# EAGLE schematic headset_br (EAGLE 6.5.0)

## Sheet 1 of 10
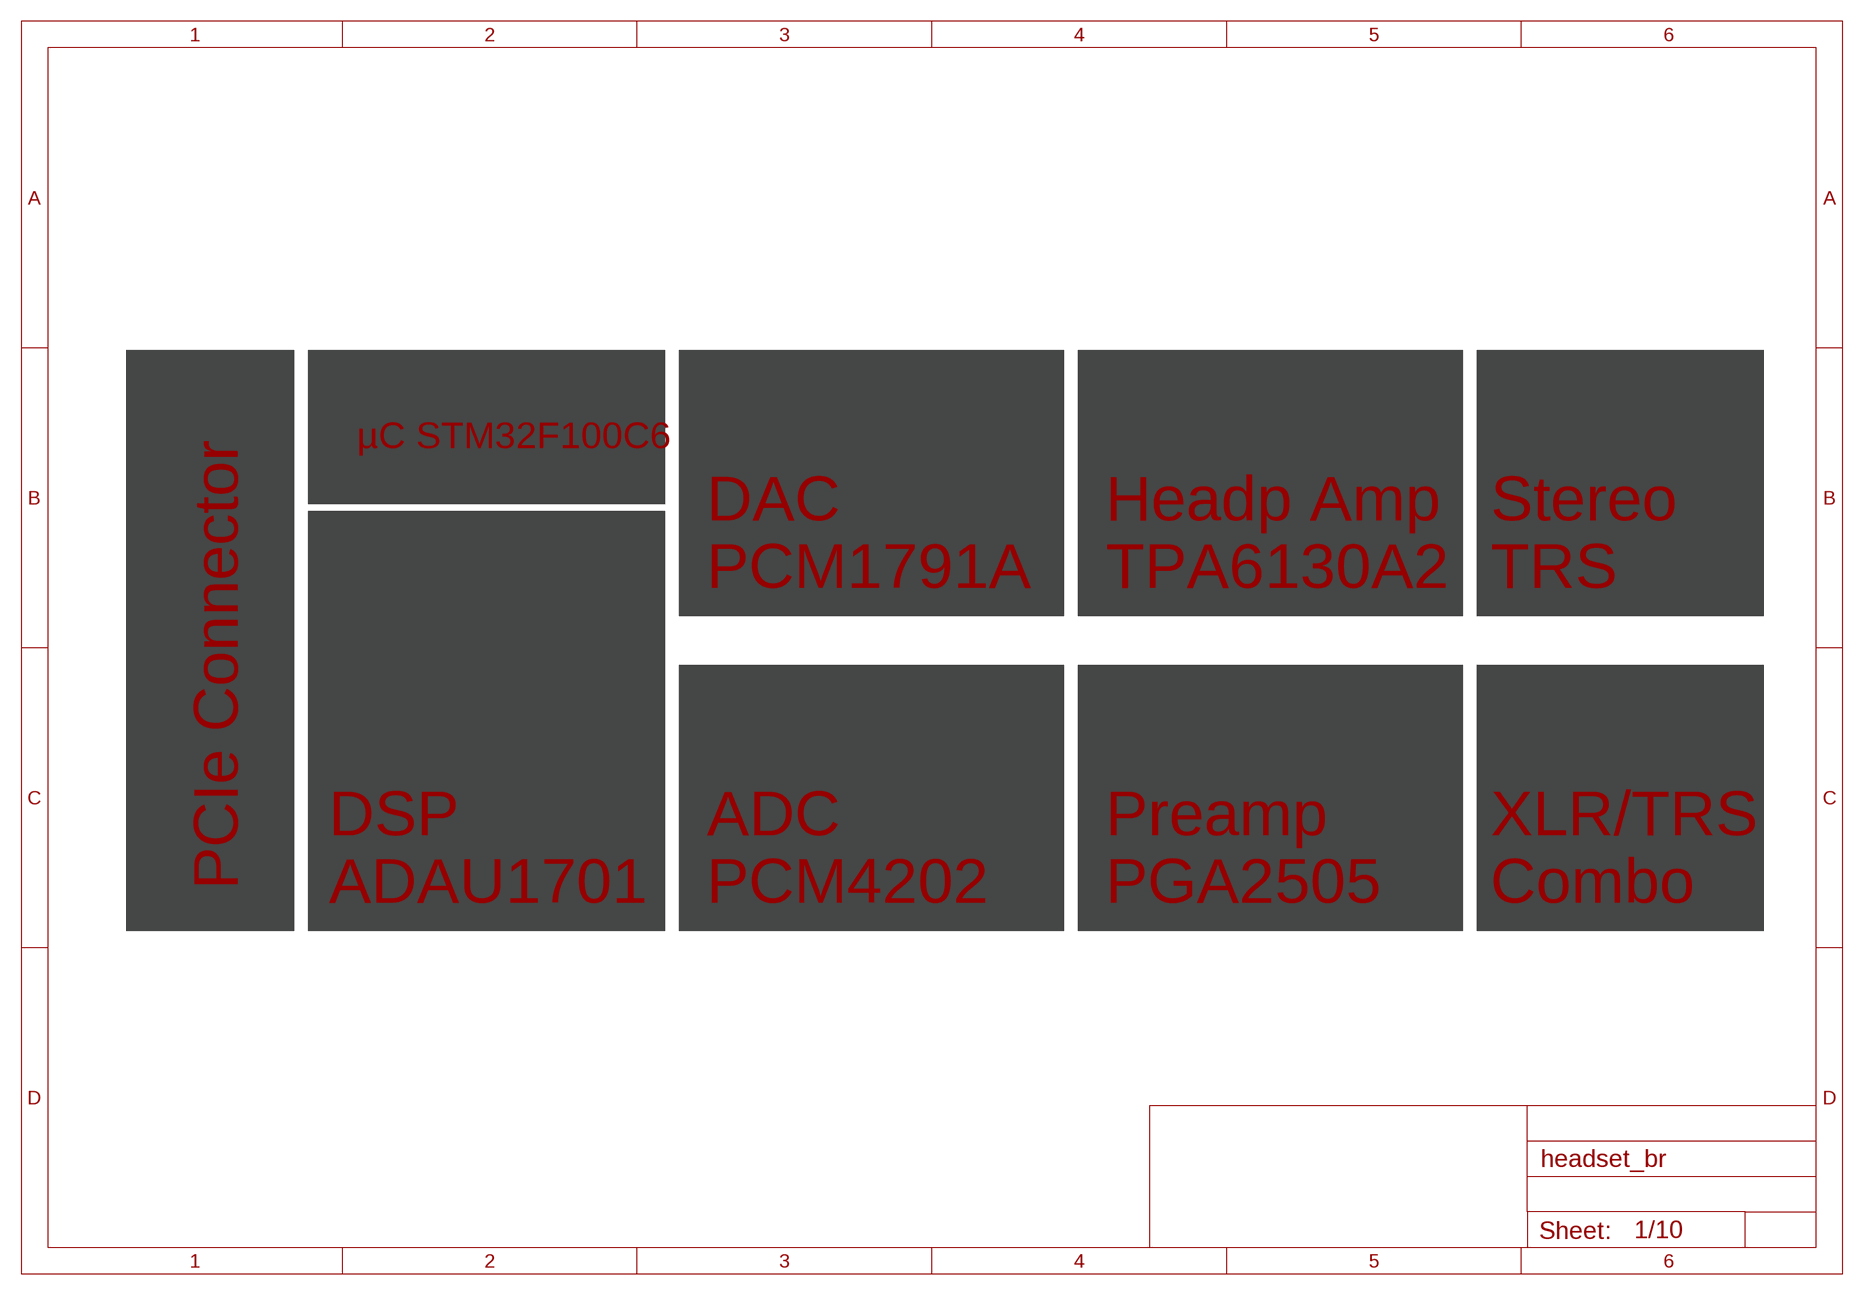
[diagram p0: schematic, sheet 1]
FRAME1 (FRAME): EXCLUDE_FROM_BOM: YES

### Notes on the sheet
- µC STM32F100C6
- DAC
  PCM1791A
- Headp Amp
  TPA6130A2
- Stereo
  TRS
- PCIe Connector
- DSP
  ADAU1701
- ADC
  PCM4202
- Preamp
  PGA2505
- XLR/TRS
  Combo

## Sheet 2 of 10
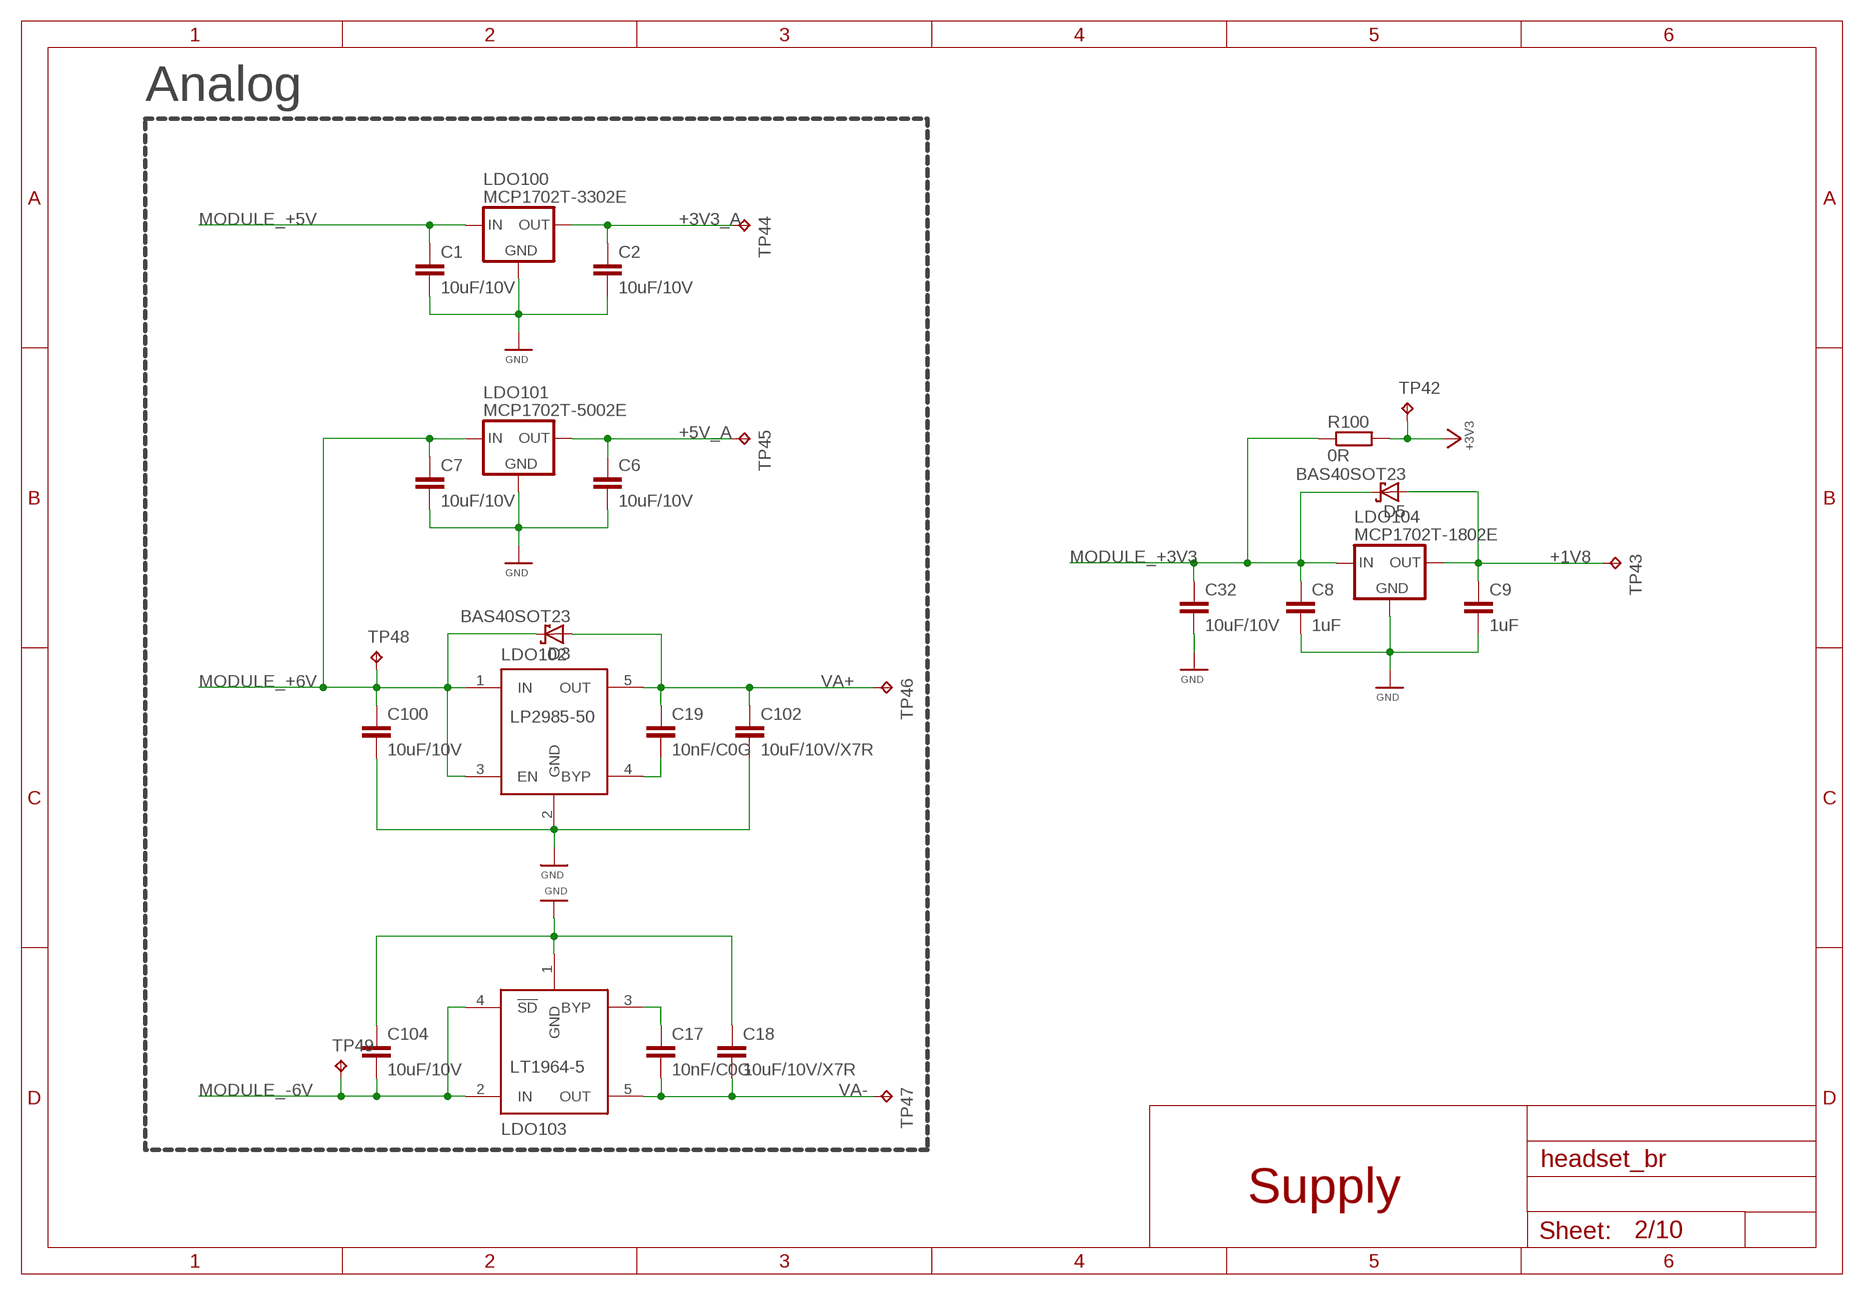
[diagram p1: schematic, sheet 2]
FRAME7 (FRAME): EXCLUDE_FROM_BOM: YES

### Parts
C1  10uF/10V  C0805  [C0805]
C2  10uF/10V  C0805  [C0805]
C6  10uF/10V  C0805  [C0805]
C7  10uF/10V  C0805  [C0805]
C8  1uF  C0603  [C0603]
C9  1uF  C0603  [C0603]
C17  10nF/C0G  C0603  [C0603]
C18  10uF/10V/X7R  C0805  [C0805]
C19  10nF/C0G  C0603  [C0603]
C32  10uF/10V  C0805  [C0805]
C100  10uF/10V  C0805  [C0805]
C102  10uF/10V/X7R  C0805  [C0805]
C104  10uF/10V  C0805  [C0805]
D3  BAS40SOT23  [SOT23]
D5  BAS40SOT23  [SOT23]
LDO100  MCP1702T-3302E  MCP1700  [SOT23]
LDO101  MCP1702T-5002E  MCP1700  [SOT23]
LDO102  LP2985-50  LP2985  [SOT23-5]
LDO103  LT1964-5  [SOT23-5]
LDO104  MCP1702T-1802E  MCP1700  [SOT23]
R100  0R  R0603  [R0603]
TP42  TPS  [TESTPAD_SMALL]
TP43  TPS  [TESTPAD_SMALL]
TP44  TPS  [TESTPAD_SMALL]
TP45  TPS  [TESTPAD_SMALL]
TP46  TPS  [TESTPAD_SMALL]
TP47  TPS  [TESTPAD_SMALL]
TP48  TPS  [TESTPAD_SMALL]
TP49  TPS  [TESTPAD_SMALL]

### Nets
+1V8: C9.1 D5.1(A) LDO104.2(OUT) TP43.P$1(TP) ; also sheet 5
+3V3: R100.2 TP42.P$1(TP) ; also sheet 4,5,10
+3V3_A: C2.1 LDO100.2(OUT) TP44.P$1(TP) ; also sheet 7,8,9
+5V_A: C6.1 LDO101.2(OUT) TP45.P$1(TP) ; also sheet 7,8,9
GND: C1.2 C2.2 C6.2 C7.2 C8.2 C9.2 C18.1 C32.2 C100.2 C102.2 C104.1 LDO100.1(GND) LDO101.1(GND) LDO102.2(GND) LDO103.1(GND) LDO104.1(GND) ; also sheet 3,4,5,6,7,8,9,10
MODULE_+3V3: C8.1 C32.1 D5.3(C) LDO104.3(IN) R100.1 ; also sheet 10
MODULE_+5V: C1.1 LDO100.3(IN) ; also sheet 10
MODULE_+6V: C7.1 C100.1 D3.3(C) LDO101.3(IN) LDO102.1(IN) LDO102.3(EN) TP48.P$1(TP) ; also sheet 10
MODULE_-6V: C104.2 LDO103.2(IN) LDO103.4(!SD) TP49.P$1(TP) ; also sheet 10
N$57: C17.1 LDO103.3(BYP)
N$58: C19.2 LDO102.4(BYP)
VA+: C19.1 C102.1 D3.1(A) LDO102.5(OUT) TP46.P$1(TP) ; also sheet 6
VA-: C17.2 C18.2 LDO103.5(OUT) TP47.P$1(TP) ; also sheet 6

### Notes on the sheet
- Analog
- Supply

## Sheet 3 of 10
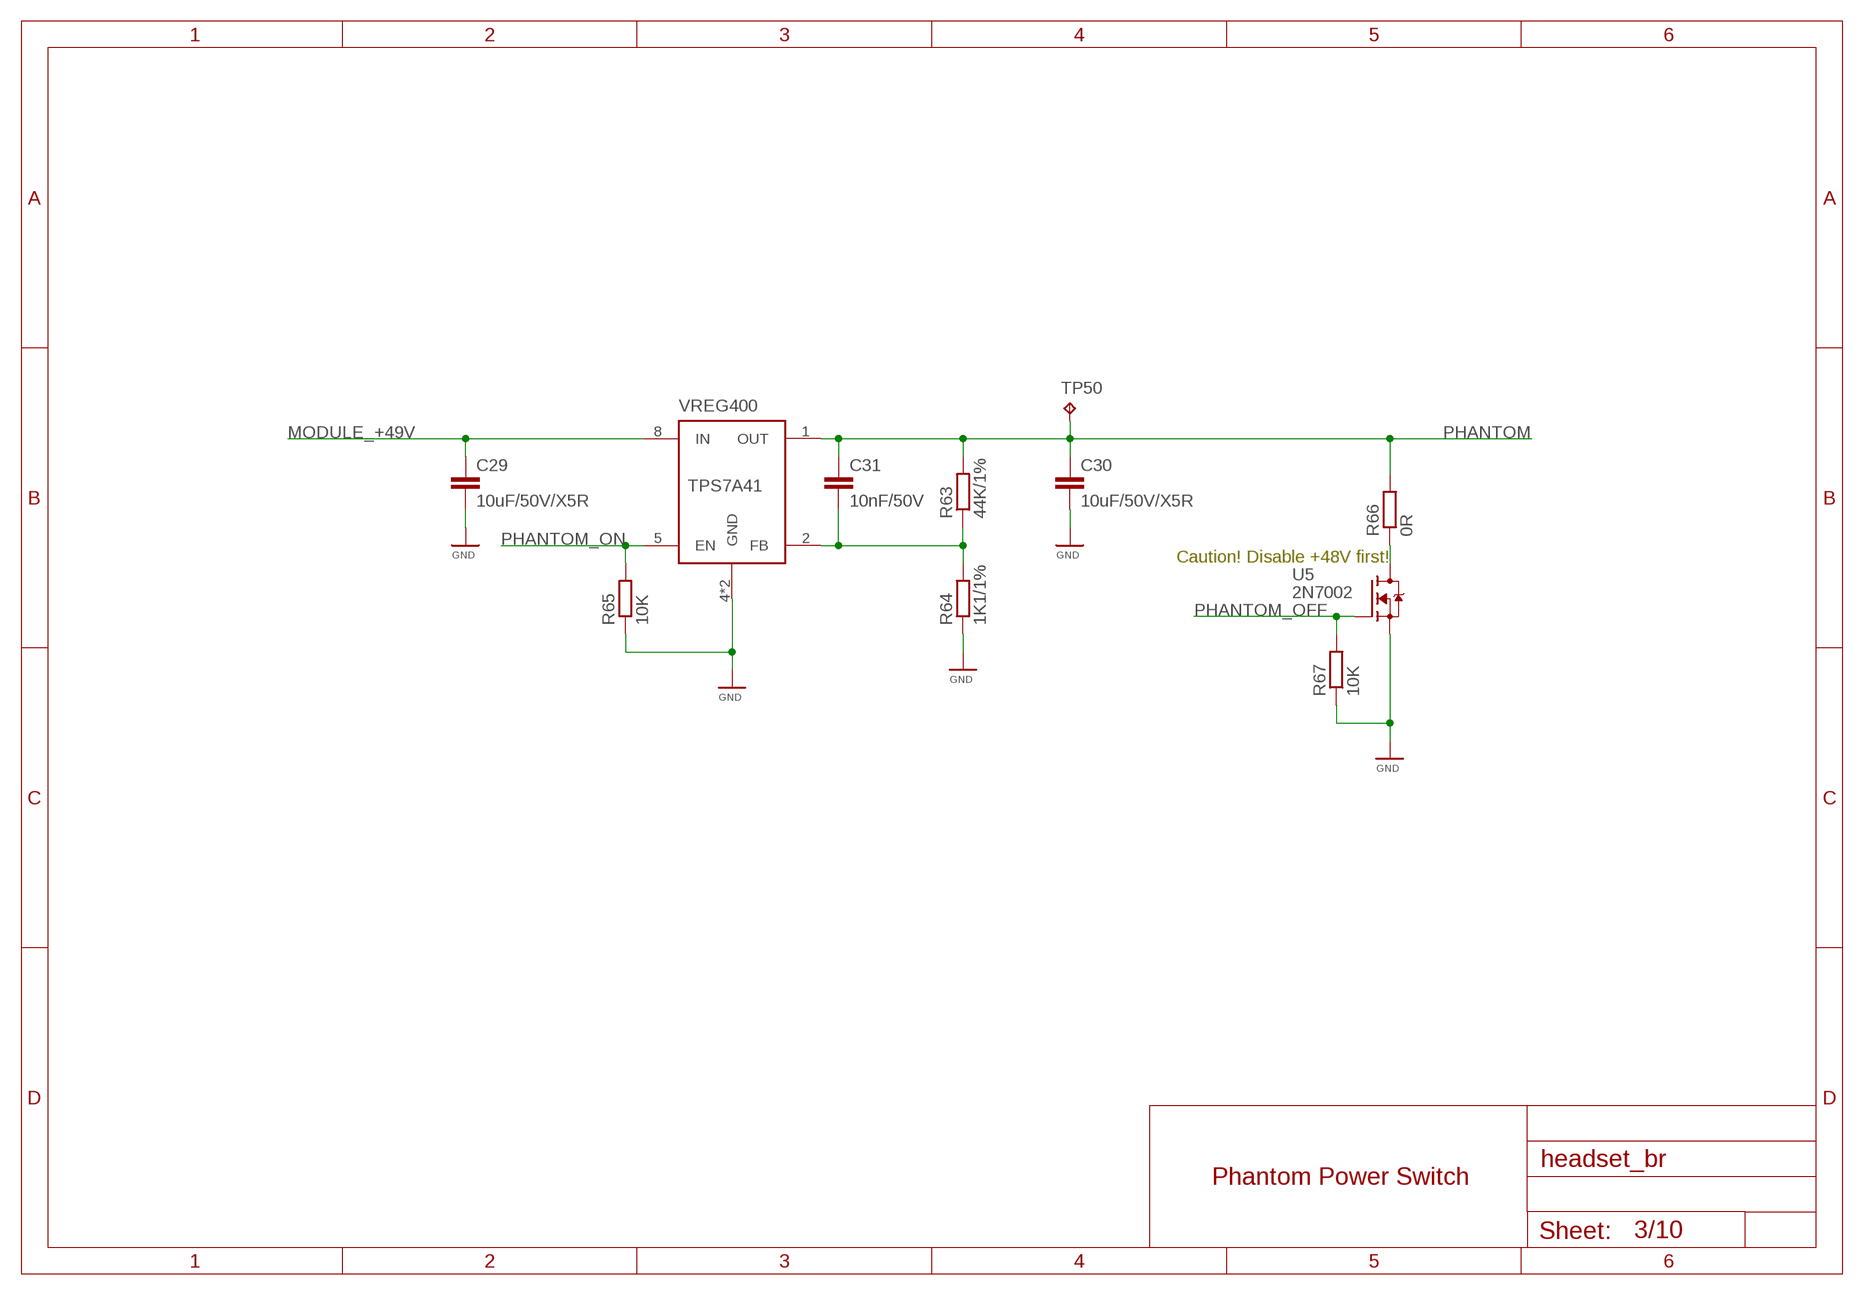
[diagram p2: schematic, sheet 3]
FRAME10 (FRAME): EXCLUDE_FROM_BOM: YES

### Parts
C29  10uF/50V/X5R  C1206  [C1206]
C30  10uF/50V/X5R  C1206  [C1206]
C31  10nF/50V  C0603  [C0603]
R63  44K/1%  R0603  [R0603]
R64  1K1/1%  R0603  [R0603]
R65  10K  R0603  [R0603]
R66  0R  R0603  [R0603]
R67  10K  R0603  [R0603]
TP50  TPS  [TESTPAD_SMALL]
U5  2N7002  [SOT23]
VREG400  TPS7A41  [TPS7A41]

### Nets
GND: C29.2 C30.2 R64.1 R65.1 R67.1 U5.2(S) VREG400.4(GND) VREG400.POWERPAD(GND) ; also sheet 2,4,5,6,7,8,9,10
MODULE_+49V: C29.1 VREG400.8(IN) ; also sheet 10
N$106: C31.2 R63.1 R64.2 VREG400.2(FB)
N$107: R66.1 U5.3(D)
PHANTOM: C30.1 C31.1 R63.2 R66.2 TP50.P$1(TP) VREG400.1(OUT) ; also sheet 6
PHANTOM_OFF: R67.2 U5.1(G) ; also sheet 4
PHANTOM_ON: R65.2 VREG400.5(EN) ; also sheet 4

### Notes on the sheet
- Caution! Disable +48V first!
- Phantom Power Switch

## Sheet 4 of 10
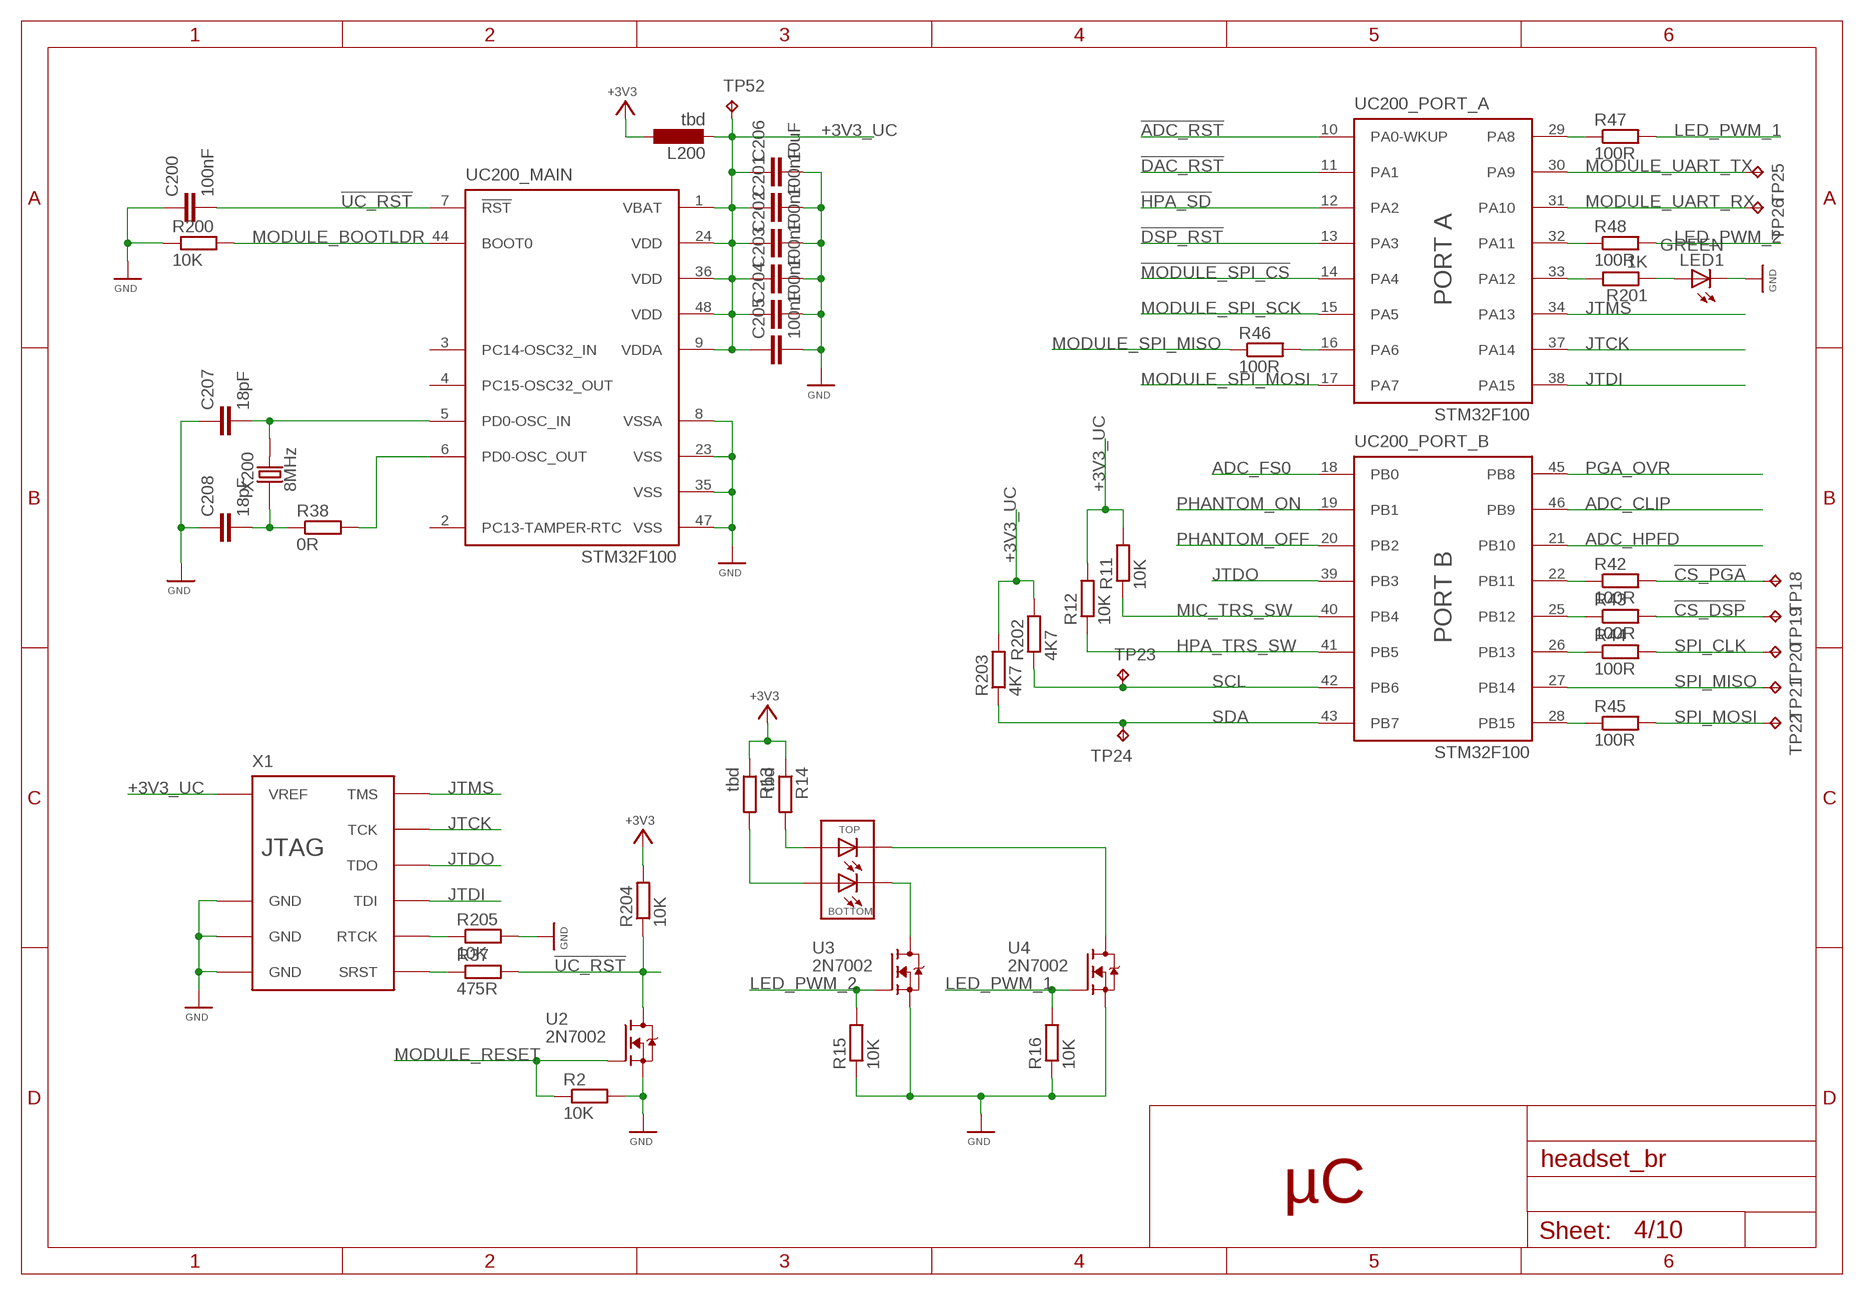
[diagram p3: schematic, sheet 4]
FRAME3 (FRAME): EXCLUDE_FROM_BOM: YES

### Parts
C200  100nF  C0603  [C0603]
C201  100nF  C0603  [C0603]
C202  100nF  C0603  [C0603]
C203  100nF  C0603  [C0603]
C204  100nF  C0603  [C0603]
C205  100nF  C0603  [C0603]
C206  10uF  C0805  [C0805]
C207  18pF  C0603  [C0603]
C208  18pF  C0603  [C0603]
DUOLED  MENTOR-2LEDRED/GREEN  [MENTOR-2LED]
L200  tbd  L0805  [R0805]
LED1  GREEN  LED0603  [CHIP-LED0603]
R2  10K  R0603  [R0603]
R11  10K  R0603  [R0603]
R12  10K  R0603  [R0603]
R13  tbd  R0603  [R0603]
R14  tbd  R0603  [R0603]
R15  10K  R0603  [R0603]
R16  10K  R0603  [R0603]
R37  475R  R0603  [R0603]
R38  0R  R0603  [R0603]
R42  100R  R0603  [R0603]
R43  100R  R0603  [R0603]
R44  100R  R0603  [R0603]
R45  100R  R0603  [R0603]
R46  100R  R0603  [R0603]
R47  100R  R0603  [R0603]
R48  100R  R0603  [R0603]
R200  10K  R0603  [R0603]
R201  1K  R0603  [R0603]
R202  4K7  R0603  [R0603]
R203  4K7  R0603  [R0603]
R204  10K  R0603  [R0603]
R205  10K  R0603  [R0603]
TP18  TPS  [TESTPAD_SMALL]
TP19  TPS  [TESTPAD_SMALL]
TP20  TPS  [TESTPAD_SMALL]
TP21  TPS  [TESTPAD_SMALL]
TP22  TPS  [TESTPAD_SMALL]
TP23  TPS  [TESTPAD_SMALL]
TP24  TPS  [TESTPAD_SMALL]
TP25  TPS  [TESTPAD_SMALL]
TP26  TPS  [TESTPAD_SMALL]
TP52  TPS  [TESTPAD_SMALL]
U2  2N7002  [SOT23]
U3  2N7002  [SOT23]
U4  2N7002  [SOT23]
UC200  STM32F100XXLQFP48  [LQFP48]
X1  JTAG  [FTS-105-01-X-DV]
X200  8MHz  CRYSTALABRACON_ABM7  [ABRACON_ABM7]

### Nets
!ADC_RST: UC200.10(_PORT_A:PA0-WKUP) ; also sheet 7
!CS_DSP: R43.2 TP19.P$1(TP) ; also sheet 5
!CS_PGA: R42.2 TP18.P$1(TP) ; also sheet 6
!DAC_RST: UC200.11(_PORT_A:PA1) ; also sheet 8
!DSP_RST: UC200.13(_PORT_A:PA3) ; also sheet 5
!HPA_SD: UC200.12(_PORT_A:PA2) ; also sheet 9
!MODULE_SPI_CS: UC200.14(_PORT_A:PA4) ; also sheet 10
!UC_RST: C200.2 R37.2 R204.1 U2.3(D) UC200.7(_MAIN:!RST)
+3V3: L200.1 R13.1 R14.1 R204.2 ; also sheet 2,5,10
+3V3_UC: C201.1 C202.1 C203.1 C204.1 C205.1 C206.1 L200.2 R11.2 R12.2 R202.2 R203.2 TP52.P$1(TP) UC200.1(_MAIN:VBAT) UC200.9(_MAIN:VDDA) UC200.24(_MAIN:VDD) UC200.36(_MAIN:VDD) UC200.48(_MAIN:VDD) X1.1(VREF)
ADC_CLIP: UC200.46(_PORT_B:PB9) ; also sheet 7
ADC_FS0: UC200.18(_PORT_B:PB0) ; also sheet 7
ADC_HPFD: UC200.21(_PORT_B:PB10) ; also sheet 7
GND: C200.1 C201.2 C202.2 C203.2 C204.2 C205.2 C206.2 C207.1 C208.1 LED1.C R2.2 R15.1 R16.1 R200.1 R205.2 U2.2(S) U3.2(S) U4.2(S) UC200.8(_MAIN:VSSA) UC200.23(_MAIN:VSS) UC200.35(_MAIN:VSS) UC200.47(_MAIN:VSS) X1.3(GND) X1.5(GND) X1.9(GND) ; also sheet 2,3,5,6,7,8,9,10
HPA_TRS_SW: R12.1 UC200.41(_PORT_B:PB5) ; also sheet 9
JTCK: UC200.37(_PORT_A:PA14) X1.4(TCK)
JTDI: UC200.38(_PORT_A:PA15) X1.8(TDI)
JTDO: UC200.39(_PORT_B:PB3) X1.6(TDO)
JTMS: UC200.34(_PORT_A:PA13) X1.2(TMS)
LED_PWM_1: R16.2 R47.2 U4.1(G)
LED_PWM_2: R15.2 R48.2 U3.1(G)
MIC_TRS_SW: R11.1 UC200.40(_PORT_B:PB4) ; also sheet 6
MODULE_BOOTLDR: R200.2 UC200.44(_MAIN:BOOT0) ; also sheet 10
MODULE_RESET: R2.1 U2.1(G) ; also sheet 10
MODULE_SPI_MISO: R46.1 ; also sheet 10
MODULE_SPI_MOSI: UC200.17(_PORT_A:PA7) ; also sheet 10
MODULE_SPI_SCK: UC200.15(_PORT_A:PA5) ; also sheet 10
MODULE_UART_RX: TP26.P$1(TP) UC200.31(_PORT_A:PA10) ; also sheet 10
MODULE_UART_TX: TP25.P$1(TP) UC200.30(_PORT_A:PA9) ; also sheet 10
N$4: R205.1 X1.7(RTCK)
N$30: LED1.A R201.1
N$31: R201.2 UC200.33(_PORT_A:PA12)
N$40: C207.2 UC200.5(_MAIN:PD0-OSC_IN) X200.P$2
N$41: R38.2 UC200.6(_MAIN:PD0-OSC_OUT)
N$42: DUOLED.A_BOTTOM R13.2
N$47: DUOLED.A_TOP R14.2
N$54: DUOLED.C_BOTTOM U3.3(D)
N$55: DUOLED.C_TOP U4.3(D)
N$81: R37.1 X1.10(SRST)
N$82: C208.2 R38.1 X200.P$1
N$86: R42.1 UC200.22(_PORT_B:PB11)
N$87: R43.1 UC200.25(_PORT_B:PB12)
N$88: R44.1 UC200.26(_PORT_B:PB13)
N$89: R45.1 UC200.28(_PORT_B:PB15)
N$90: R46.2 UC200.16(_PORT_A:PA6)
N$91: R48.1 UC200.32(_PORT_A:PA11)
N$92: R47.1 UC200.29(_PORT_A:PA8)
PGA_OVR: UC200.45(_PORT_B:PB8) ; also sheet 6
PHANTOM_OFF: UC200.20(_PORT_B:PB2) ; also sheet 3
PHANTOM_ON: UC200.19(_PORT_B:PB1) ; also sheet 3
SCL: R202.1 TP23.P$1(TP) UC200.42(_PORT_B:PB6) ; also sheet 8,9
SDA: R203.1 TP24.P$1(TP) UC200.43(_PORT_B:PB7) ; also sheet 8,9
SPI_CLK: R44.2 TP20.P$1(TP) ; also sheet 5,6
SPI_MISO: TP21.P$1(TP) UC200.27(_PORT_B:PB14) ; also sheet 5
SPI_MOSI: R45.2 TP22.P$1(TP) ; also sheet 5,6
Unconnected: UC200.2(_MAIN:PC13-TAMPER-RTC) UC200.3(_MAIN:PC14-OSC32_IN) UC200.4(_MAIN:PC15-OSC32_OUT)

### Notes on the sheet
- µC

## Sheet 5 of 10
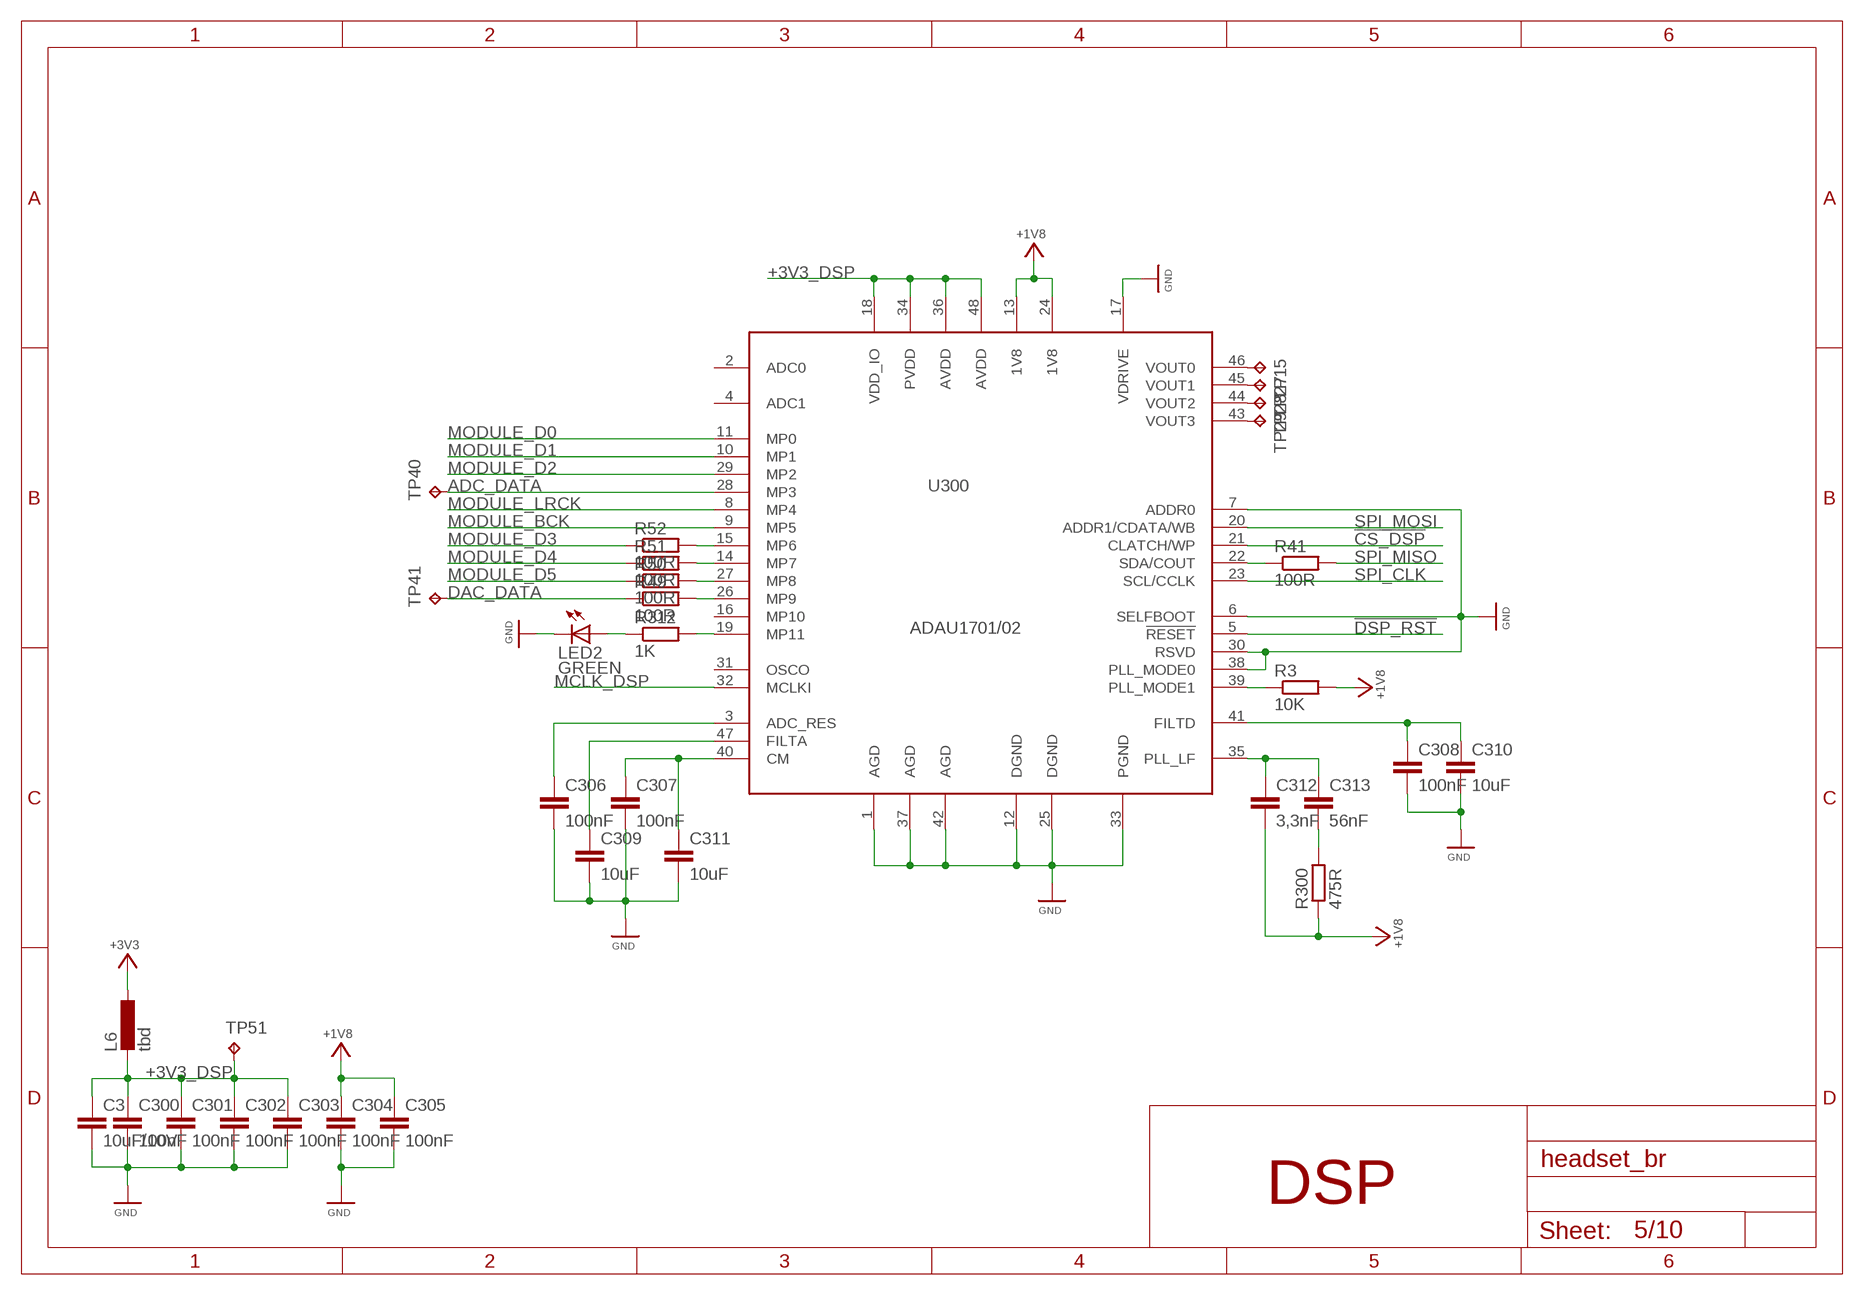
[diagram p4: schematic, sheet 5]
FRAME2 (FRAME): EXCLUDE_FROM_BOM: YES

### Parts
C3  10uF/10V  C0805  [C0805]
C300  100nF  C0603  [C0603]
C301  100nF  C0603  [C0603]
C302  100nF  C0603  [C0603]
C303  100nF  C0603  [C0603]
C304  100nF  C0603  [C0603]
C305  100nF  C0603  [C0603]
C306  100nF  C0603  [C0603]
C307  100nF  C0603  [C0603]
C308  100nF  C0603  [C0603]
C309  10uF  C1206  [C1206]
C310  10uF  C1206  [C1206]
C311  10uF  C1206  [C1206]
C312  3,3nF  C0603  [C0603]
C313  56nF  C0603  [C0603]
L6  tbd  L0805  [R0805]
LED2  GREEN  LED0603  [CHIP-LED0603]
R3  10K  R0603  [R0603]
R41  100R  R0603  [R0603]
R49  100R  R0603  [R0603]
R50  100R  R0603  [R0603]
R51  100R  R0603  [R0603]
R52  100R  R0603  [R0603]
R300  475R  R0603  [R0603]
R312  1K  R0603  [R0603]
TP15  TPXS  [TESTPAD_EXTRA_SMALL]
TP27  TPXS  [TESTPAD_EXTRA_SMALL]
TP28  TPXS  [TESTPAD_EXTRA_SMALL]
TP29  TPXS  [TESTPAD_EXTRA_SMALL]
TP40  TPS  [TESTPAD_SMALL]
TP41  TPS  [TESTPAD_SMALL]
TP51  TPS  [TESTPAD_SMALL]
U300  ADAU1701/02ADAU1701JSTZ  [LQFP48]

### Nets
!CS_DSP: U300.21(CLATCH/WP) ; also sheet 4
!DSP_RST: U300.5(!RESET) ; also sheet 4
+1V8: C304.1 C305.1 C312.2 R3.2 R300.1 U300.13(1V8) U300.24(1V8) ; also sheet 2
+3V3: L6.1 ; also sheet 2,4,10
+3V3_DSP: C3.1 C300.1 C301.1 C302.1 C303.1 L6.2 TP51.P$1(TP) U300.18(VDD_IO) U300.34(PVDD) U300.36(AVDD) U300.48(AVDD)
ADC_DATA: TP40.P$1(TP) U300.28(MP3) ; also sheet 7
DAC_DATA: R49.1 TP41.P$1(TP) ; also sheet 8
GND: C3.2 C300.2 C301.2 C302.2 C303.2 C304.2 C305.2 C306.2 C307.2 C308.2 C309.2 C310.2 C311.2 LED2.C U300.1(AGD) U300.6(SELFBOOT) U300.7(ADDR0) U300.12(DGND) U300.17(VDRIVE) U300.25(DGND) U300.30(RSVD) U300.33(PGND) U300.37(AGD) U300.38(PLL_MODE0) U300.42(AGD) ; also sheet 2,3,4,6,7,8,9,10
MCLK_DSP: U300.32(MCLKI) ; also sheet 10
MODULE_BCK: U300.9(MP5) ; also sheet 7,8,10
MODULE_D0: U300.11(MP0) ; also sheet 10
MODULE_D1: U300.10(MP1) ; also sheet 10
MODULE_D2: U300.29(MP2) ; also sheet 10
MODULE_D3: R52.1 ; also sheet 10
MODULE_D4: R51.1 ; also sheet 10
MODULE_D5: R50.1 ; also sheet 10
MODULE_LRCK: U300.8(MP4) ; also sheet 7,8,10
N$2: C312.1 C313.1 U300.35(PLL_LF)
N$3: C313.2 R300.2
N$6: C307.1 C311.1 U300.40(CM)
N$7: C308.1 C310.1 U300.41(FILTD)
N$18: C309.1 U300.47(FILTA)
N$19: C306.1 U300.3(ADC_RES)
N$34: R312.2 U300.19(MP11)
N$35: LED2.A R312.1
N$38: R3.1 U300.39(PLL_MODE1)
N$43: TP15.P$1(TP) U300.46(VOUT0)
N$44: TP27.P$1(TP) U300.45(VOUT1)
N$45: TP28.P$1(TP) U300.44(VOUT2)
N$80: TP29.P$1(TP) U300.43(VOUT3)
N$85: R41.1 U300.22(SDA/COUT)
N$93: R52.2 U300.15(MP6)
N$94: R51.2 U300.14(MP7)
N$95: R50.2 U300.27(MP8)
N$96: R49.2 U300.26(MP9)
SPI_CLK: U300.23(SCL/CCLK) ; also sheet 4,6
SPI_MISO: R41.2 ; also sheet 4
SPI_MOSI: U300.20(ADDR1/CDATA/WB) ; also sheet 4,6
Unconnected: U300.2(ADC0) U300.4(ADC1) U300.16(MP10) U300.31(OSCO)

### Notes on the sheet
- DSP

## Sheet 6 of 10
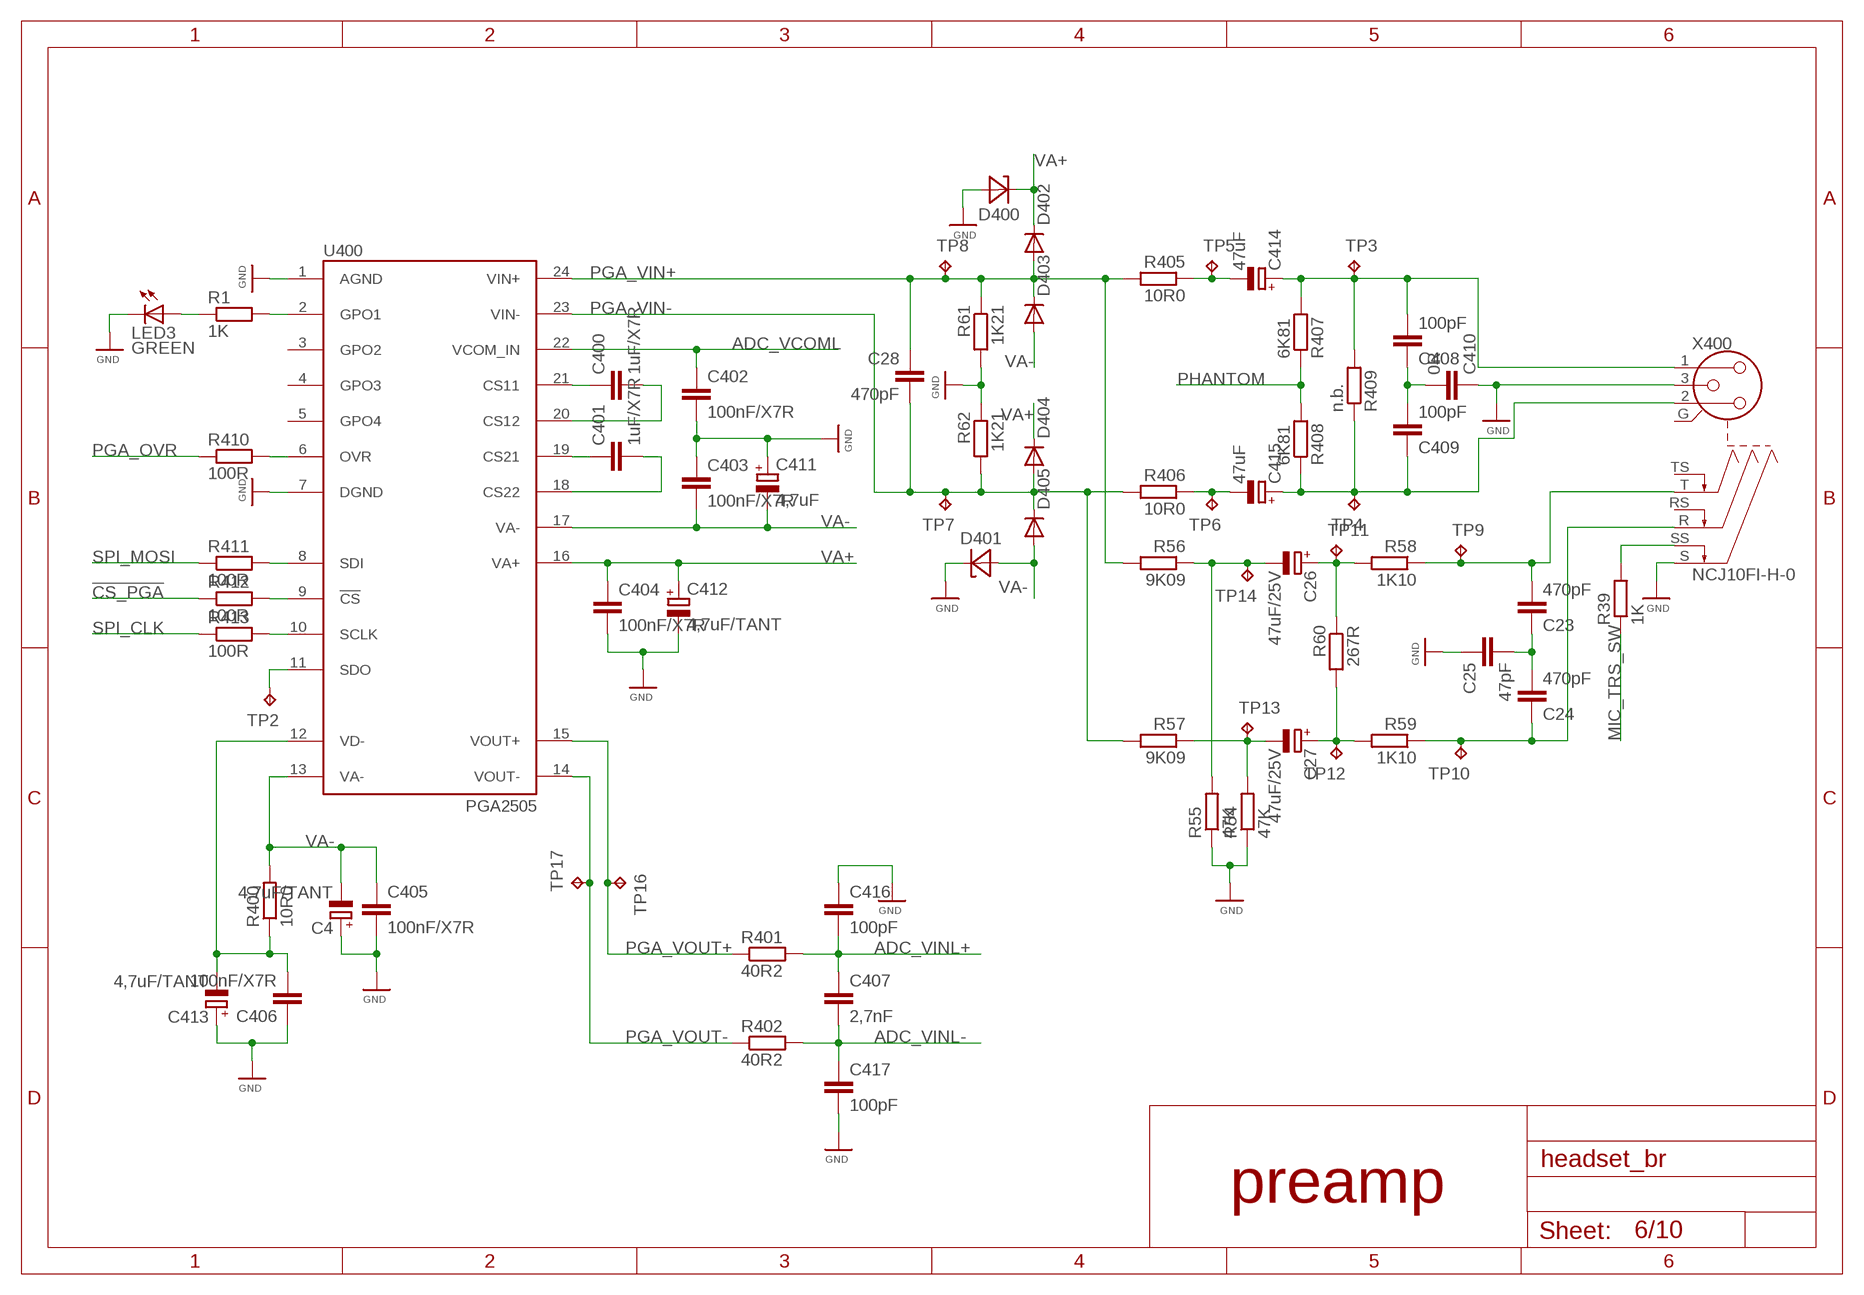
[diagram p5: schematic, sheet 6]
FRAME4 (FRAME): EXCLUDE_FROM_BOM: YES

### Parts
C4  4,7uF/TANT  CPOL_B  [SMC_B]
C23  470pF  C0603  [C0603]
C24  470pF  C0603  [C0603]
C25  47pF  C0603  [C0603]
C26  47uF/25V  CPOLPANASONIC_FK_V_SIZE_D  [PANASONIC_FK_V_SIZE_D]
C27  47uF/25V  CPOLPANASONIC_FK_V_SIZE_D  [PANASONIC_FK_V_SIZE_D]
C28  470pF  C0603  [C0603]
C400  1uF/X7R  C0603  [C0603]
C401  1uF/X7R  C0603  [C0603]
C402  100nF/X7R  C0603  [C0603]
C403  100nF/X7R  C0603  [C0603]
C404  100nF/X7R  C0603  [C0603]
C405  100nF/X7R  C0603  [C0603]
C406  100nF/X7R  C0603  [C0603]
C407  2,7nF  C0603  [C0603]
C408  100pF  C0603  [C0603]
C409  100pF  C0603  [C0603]
C410  0R  C0603  [C0603]
C411  4,7uF  CPOL_B  [SMC_B]
C412  4,7uF/TANT  CPOL_B  [SMC_B]
C413  4,7uF/TANT  CPOL_B  [SMC_B]
C414  47uF  CPOLPANASONIC_FK_V_SIZE_F  [PANASONIC_FK_V_SIZE_F]
C415  47uF  CPOLPANASONIC_FK_V_SIZE_F  [PANASONIC_FK_V_SIZE_F]
C416  100pF  C0603  [C0603]
C417  100pF  C0603  [C0603]
D400  D-ZENERDO-214AC  [DO214AC]
D401  D-ZENERDO-214AC  [DO214AC]
D402  MBRA120ET3G  [SMA]
D403  MBRA120ET3G  [SMA]
D404  MBRA120ET3G  [SMA]
D405  MBRA120ET3G  [SMA]
LED3  GREEN  LED0603  [CHIP-LED0603]
R1  1K  R0603  [R0603]
R39  1K  R0603  [R0603]
R54  47K  R0603  [R0603]
R55  47K  R0603  [R0603]
R56  9K09  R1206  [R1206]
R57  9K09  R1206  [R1206]
R58  1K10  R1206  [R1206]
R59  1K10  R1206  [R1206]
R60  267R  R1206  [R1206]
R61  1K21  R0805  [R0805]
R62  1K21  R0805  [R0805]
R400  10R0  R1206  [R1206]
R401  40R2  R0805  [R0805]
R402  40R2  R0805  [R0805]
R405  10R0  R1206  [R1206]
R406  10R0  R1206  [R1206]
R407  6K81  R1206  [R1206]
R408  6K81  R1206  [R1206]
R409  n.b.  R0805  [R0805]
R410  100R  R0603  [R0603]
R411  100R  R0603  [R0603]
R412  100R  R0603  [R0603]
R413  100R  R0603  [R0603]
TP2  TPS  [TESTPAD_SMALL]
TP3  TP  [TESTPAD]
TP4  TP  [TESTPAD]
TP5  TP  [TESTPAD]
TP6  TP  [TESTPAD]
TP7  TP  [TESTPAD]
TP8  TP  [TESTPAD]
TP9  TP  [TESTPAD]
TP10  TP  [TESTPAD]
TP11  TP  [TESTPAD]
TP12  TP  [TESTPAD]
TP13  TP  [TESTPAD]
TP14  TP  [TESTPAD]
TP16  TPS  [TESTPAD_SMALL]
TP17  TPS  [TESTPAD_SMALL]
U400  PGA2505  [SSOP24]
X400  NCJ10FI-H-0  [NCJ10FI-H-0]

### Nets
!CS_PGA: R412.1 ; also sheet 4
ADC_VCOML: C402.1 U400.22(VCOM_IN) ; also sheet 7
ADC_VINL+: C407.1 C416.2 R401.2 ; also sheet 7
ADC_VINL-: C407.2 C417.1 R402.2 ; also sheet 7
GND: C4.+ C25.1 C402.2 C403.1 C404.2 C405.2 C406.1 C410.1 C411.+ C412.- C413.+ C416.1 C417.2 D400.A D401.C LED3.C R54.1 R55.1 R61.2 R62.1 U400.1(AGND) U400.7(DGND) X400.3 X400.S ; also sheet 2,3,4,5,7,8,9,10
MIC_TRS_SW: R39.1 ; also sheet 4
N$1: C408.1 C409.2 C410.2
N$10: C414.M(-) R405.1 TP5.P$1(TP)
N$11: C415.M(-) R406.1 TP6.P$1(TP)
N$13: C400.1 U400.21(CS11)
N$14: C400.2 U400.20(CS12)
N$15: C406.2 C413.- R400.1 U400.12(VD-)
N$16: C401.1 U400.19(CS21)
N$17: C401.2 U400.18(CS22)
N$36: R1.2 U400.2(GPO1)
N$37: LED3.A R1.1
N$64: R410.2 U400.6(OVR)
N$65: R411.2 U400.8(SDI)
N$66: R412.2 U400.9(!CS)
N$67: R413.2 U400.10(SCLK)
N$68: TP2.P$1(TP) U400.11(SDO)
N$83: R39.2 X400.SS
N$98: C23.1 C24.2 C25.2
N$99: C27.P(+) R59.2 R60.2 TP12.P$1(TP)
N$100: C23.2 R58.1 TP9.P$1(TP) X400.T
N$101: C24.1 R59.1 TP10.P$1(TP) X400.R
N$102: C27.N(-) R54.2 R57.1 TP13.P$1(TP)
N$103: C26.N(-) R55.2 R56.1 TP14.P$1(TP)
N$104: C26.P(+) R58.2 R60.1 TP11.P$1(TP)
PGA_OVR: R410.1 ; also sheet 4
PGA_VIN+: C28.1 D402.A D403.C R56.2 R61.1 R405.2 TP8.P$1(TP) U400.24(VIN+)
PGA_VIN-: C28.2 D404.A D405.C R57.2 R62.2 R406.2 TP7.P$1(TP) U400.23(VIN-)
PGA_VOUT+: R401.1 TP16.P$1(TP) U400.15(VOUT+)
PGA_VOUT-: R402.1 TP17.P$1(TP) U400.14(VOUT-)
PHANTOM: R407.1 R408.2 ; also sheet 3
SPI_CLK: R413.1 ; also sheet 4,5
SPI_MOSI: R411.1 ; also sheet 4,5
VA+: C404.1 C412.+ D400.C D402.C D404.C U400.16(VA+) ; also sheet 2
VA-: C4.- C403.2 C405.1 C411.- D401.A D403.A D405.A R400.2 U400.13(VA-) U400.17(VA-) ; also sheet 2
VIN+: C408.2 C414.P(+) R407.2 R409.2 TP3.P$1(TP) X400.1
VIN-: C409.1 C415.P(+) R408.1 R409.1 TP4.P$1(TP) X400.2
Unconnected: U400.3(GPO2) U400.4(GPO3) U400.5(GPO4) X400.G X400.RS X400.TS

### Notes on the sheet
- preamp

## Sheet 7 of 10
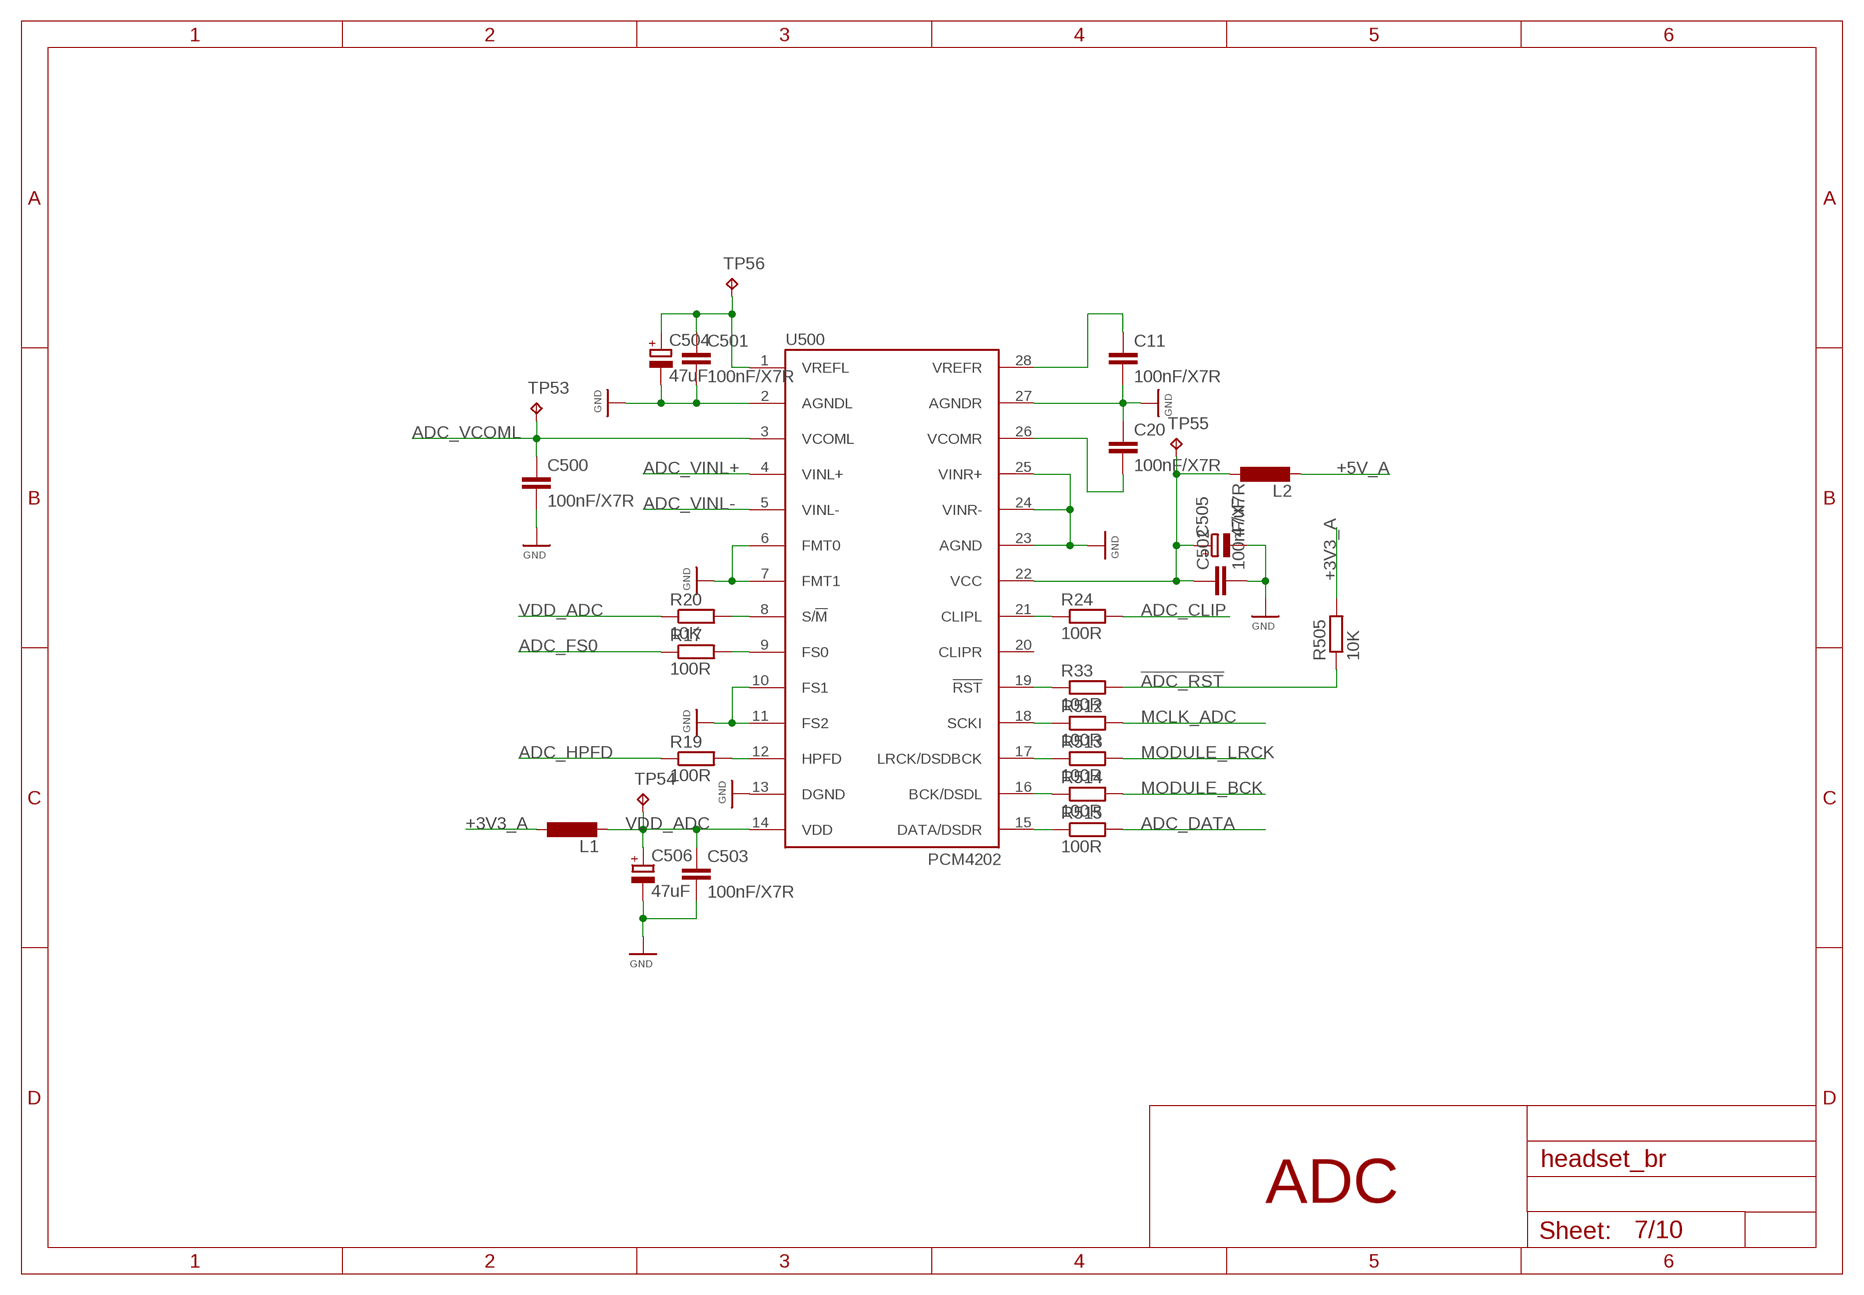
[diagram p6: schematic, sheet 7]
FRAME5 (FRAME): EXCLUDE_FROM_BOM: YES

### Parts
C11  100nF/X7R  C0603  [C0603]
C20  100nF/X7R  C0603  [C0603]
C500  100nF/X7R  C0603  [C0603]
C501  100nF/X7R  C0603  [C0603]
C502  100nF/X7R  C0603  [C0603]
C503  100nF/X7R  C0603  [C0603]
C504  47uF  CPOLVISHAY_TR3_SIZE_B  [VISHAY_TR3_SIZE_B]
C505  47uF  CPOLKEMET_EDK_5MM  [KEMET_EDK_5MM]
C506  47uF  CPOLKEMET_EDK_5MM  [KEMET_EDK_5MM]
L1  L0805  [R0805]
L2  L0805  [R0805]
R17  100R  R0603  [R0603]
R19  100R  R0603  [R0603]
R20  10K  R0603  [R0603]
R24  100R  R0603  [R0603]
R33  100R  R0603  [R0603]
R505  10K  R0603  [R0603]
R512  100R  R0603  [R0603]
R513  100R  R0603  [R0603]
R514  100R  R0603  [R0603]
R515  100R  R0603  [R0603]
TP53  TPS  [TESTPAD_SMALL]
TP54  TPS  [TESTPAD_SMALL]
TP55  TPS  [TESTPAD_SMALL]
TP56  TPS  [TESTPAD_SMALL]
U500  PCM4202  [SSOP28]

### Nets
!ADC_RST: R33.2 R505.1 ; also sheet 4
+3V3_A: L1.1 R505.2 ; also sheet 2,8,9
+5V_A: L2.2 ; also sheet 2,8,9
ADC_CLIP: R24.2 ; also sheet 4
ADC_DATA: R515.2 ; also sheet 5
ADC_FS0: R17.1 ; also sheet 4
ADC_HPFD: R19.1 ; also sheet 4
ADC_VCOML: C500.1 TP53.P$1(TP) U500.3(VCOML) ; also sheet 6
ADC_VINL+: U500.4(VINL+) ; also sheet 6
ADC_VINL-: U500.5(VINL-) ; also sheet 6
GND: C11.2 C20.1 C500.2 C501.2 C502.2 C503.2 C504.M(-) C505.M(-) C506.M(-) U500.2(AGNDL) U500.6(FMT0) U500.7(FMT1) U500.10(FS1) U500.11(FS2) U500.13(DGND) U500.23(AGND) U500.24(VINR-) U500.25(VINR+) U500.27(AGNDR) ; also sheet 2,3,4,5,6,8,9,10
MCLK_ADC: R512.2 ; also sheet 10
MODULE_BCK: R514.2 ; also sheet 5,8,10
MODULE_LRCK: R513.2 ; also sheet 5,8,10
N$5: C501.1 C504.P(+) TP56.P$1(TP) U500.1(VREFL)
N$9: C502.1 C505.P(+) L2.1 TP55.P$1(TP) U500.22(VCC)
N$46: R17.2 U500.9(FS0)
N$48: R512.1 U500.18(SCKI)
N$51: R513.1 U500.17(LRCK/DSDBCK)
N$52: R514.1 U500.16(BCK/DSDL)
N$53: R515.1 U500.15(DATA/DSDR)
N$59: R19.2 U500.12(HPFD)
N$60: R20.2 U500.8(S/!M)
N$61: R24.1 U500.21(CLIPL)
N$62: C20.2 U500.26(VCOMR)
N$63: C11.1 U500.28(VREFR)
N$76: R33.1 U500.19(!RST)
VDD_ADC: C503.1 C506.P(+) L1.2 R20.1 TP54.P$1(TP) U500.14(VDD)
Unconnected: U500.20(CLIPR)

### Notes on the sheet
- ADC

## Sheet 8 of 10
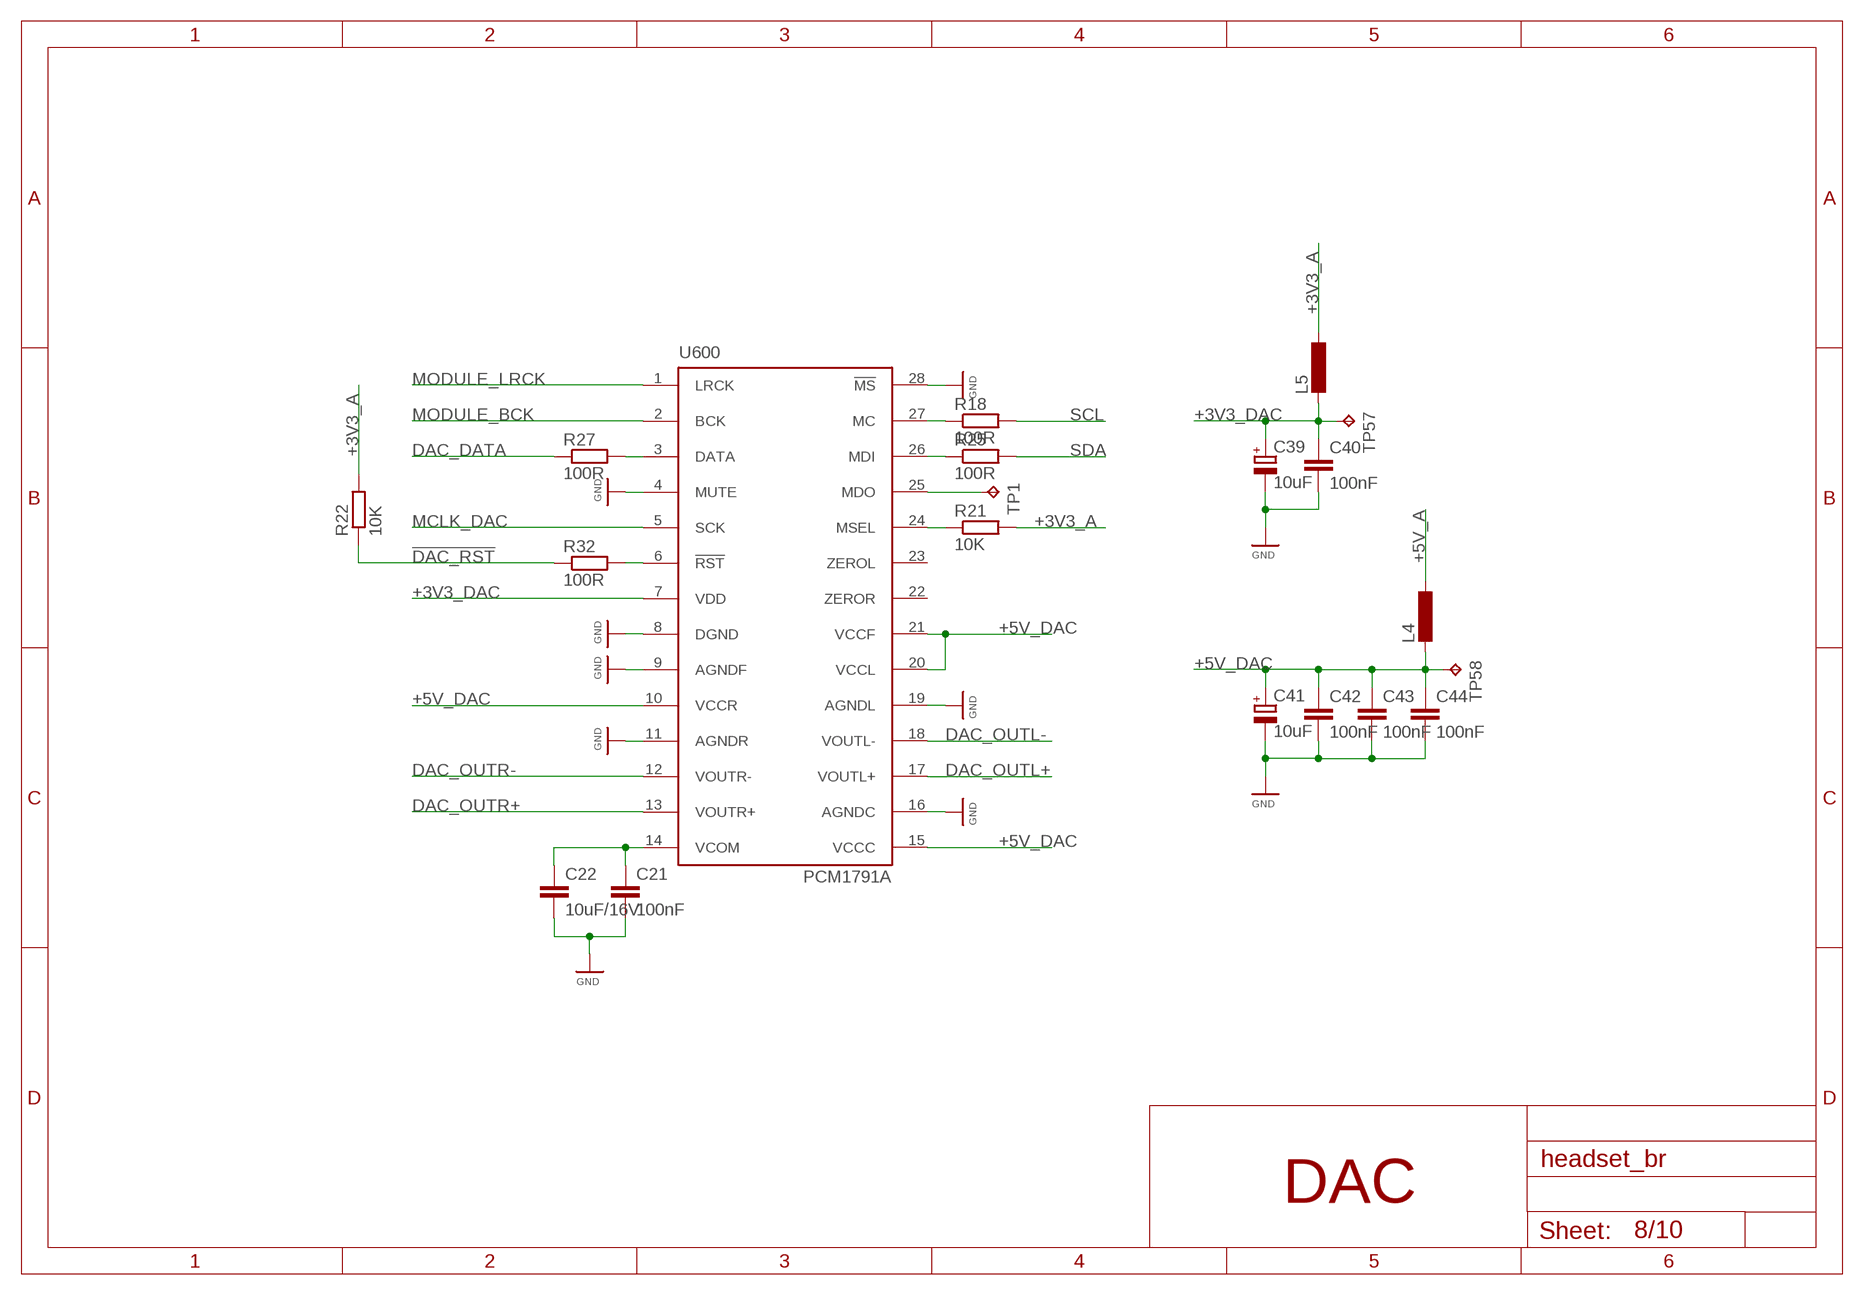
[diagram p7: schematic, sheet 8]
FRAME6 (FRAME): EXCLUDE_FROM_BOM: YES

### Parts
C21  100nF  C0603  [C0603]
C22  10uF/16V  C1206  [C1206]
C39  10uF  CPOL_A  [SMC_A]
C40  100nF  C0603  [C0603]
C41  10uF  CPOL_A  [SMC_A]
C42  100nF  C0603  [C0603]
C43  100nF  C0603  [C0603]
C44  100nF  C0603  [C0603]
L4  L0805  [R0805]
L5  L0805  [R0805]
R18  100R  R0603  [R0603]
R21  10K  R0603  [R0603]
R22  10K  R0603  [R0603]
R25  100R  R0603  [R0603]
R27  100R  R0603  [R0603]
R32  100R  R0603  [R0603]
TP1  TPS  [TESTPAD_SMALL]
TP57  TPS  [TESTPAD_SMALL]
TP58  TPS  [TESTPAD_SMALL]
U600  PCM1791A  [SSOP28]

### Nets
!DAC_RST: R22.1 R32.1 ; also sheet 4
+3V3_A: L5.1 R21.2 R22.2 ; also sheet 2,7,9
+3V3_DAC: C39.+ C40.1 L5.2 TP57.P$1(TP) U600.7(VDD)
+5V_A: L4.1 ; also sheet 2,7,9
+5V_DAC: C41.+ C42.1 C43.1 C44.1 L4.2 TP58.P$1(TP) U600.10(VCCR) U600.15(VCCC) U600.20(VCCL) U600.21(VCCF)
DAC_DATA: R27.1 ; also sheet 5
DAC_OUTL+: U600.17(VOUTL+) ; also sheet 9
DAC_OUTL-: U600.18(VOUTL-) ; also sheet 9
DAC_OUTR+: U600.13(VOUTR+) ; also sheet 9
DAC_OUTR-: U600.12(VOUTR-) ; also sheet 9
GND: C21.2 C22.2 C39.- C40.2 C41.- C42.2 C43.2 C44.2 U600.4(MUTE) U600.8(DGND) U600.9(AGNDF) U600.11(AGNDR) U600.16(AGNDC) U600.19(AGNDL) U600.28(!MS) ; also sheet 2,3,4,5,6,7,9,10
MCLK_DAC: U600.5(SCK) ; also sheet 10
MODULE_BCK: U600.2(BCK) ; also sheet 5,7,10
MODULE_LRCK: U600.1(LRCK) ; also sheet 5,7,10
N$8: TP1.P$1(TP) U600.25(MDO)
N$22: C21.1 C22.1 U600.14(VCOM)
N$39: R21.1 U600.24(MSEL)
N$56: R18.1 U600.27(MC)
N$69: R25.1 U600.26(MDI)
N$70: R27.2 U600.3(DATA)
N$75: R32.2 U600.6(!RST)
SCL: R18.2 ; also sheet 4,9
SDA: R25.2 ; also sheet 4,9
Unconnected: U600.22(ZEROR) U600.23(ZEROL)

### Notes on the sheet
- DAC

## Sheet 9 of 10
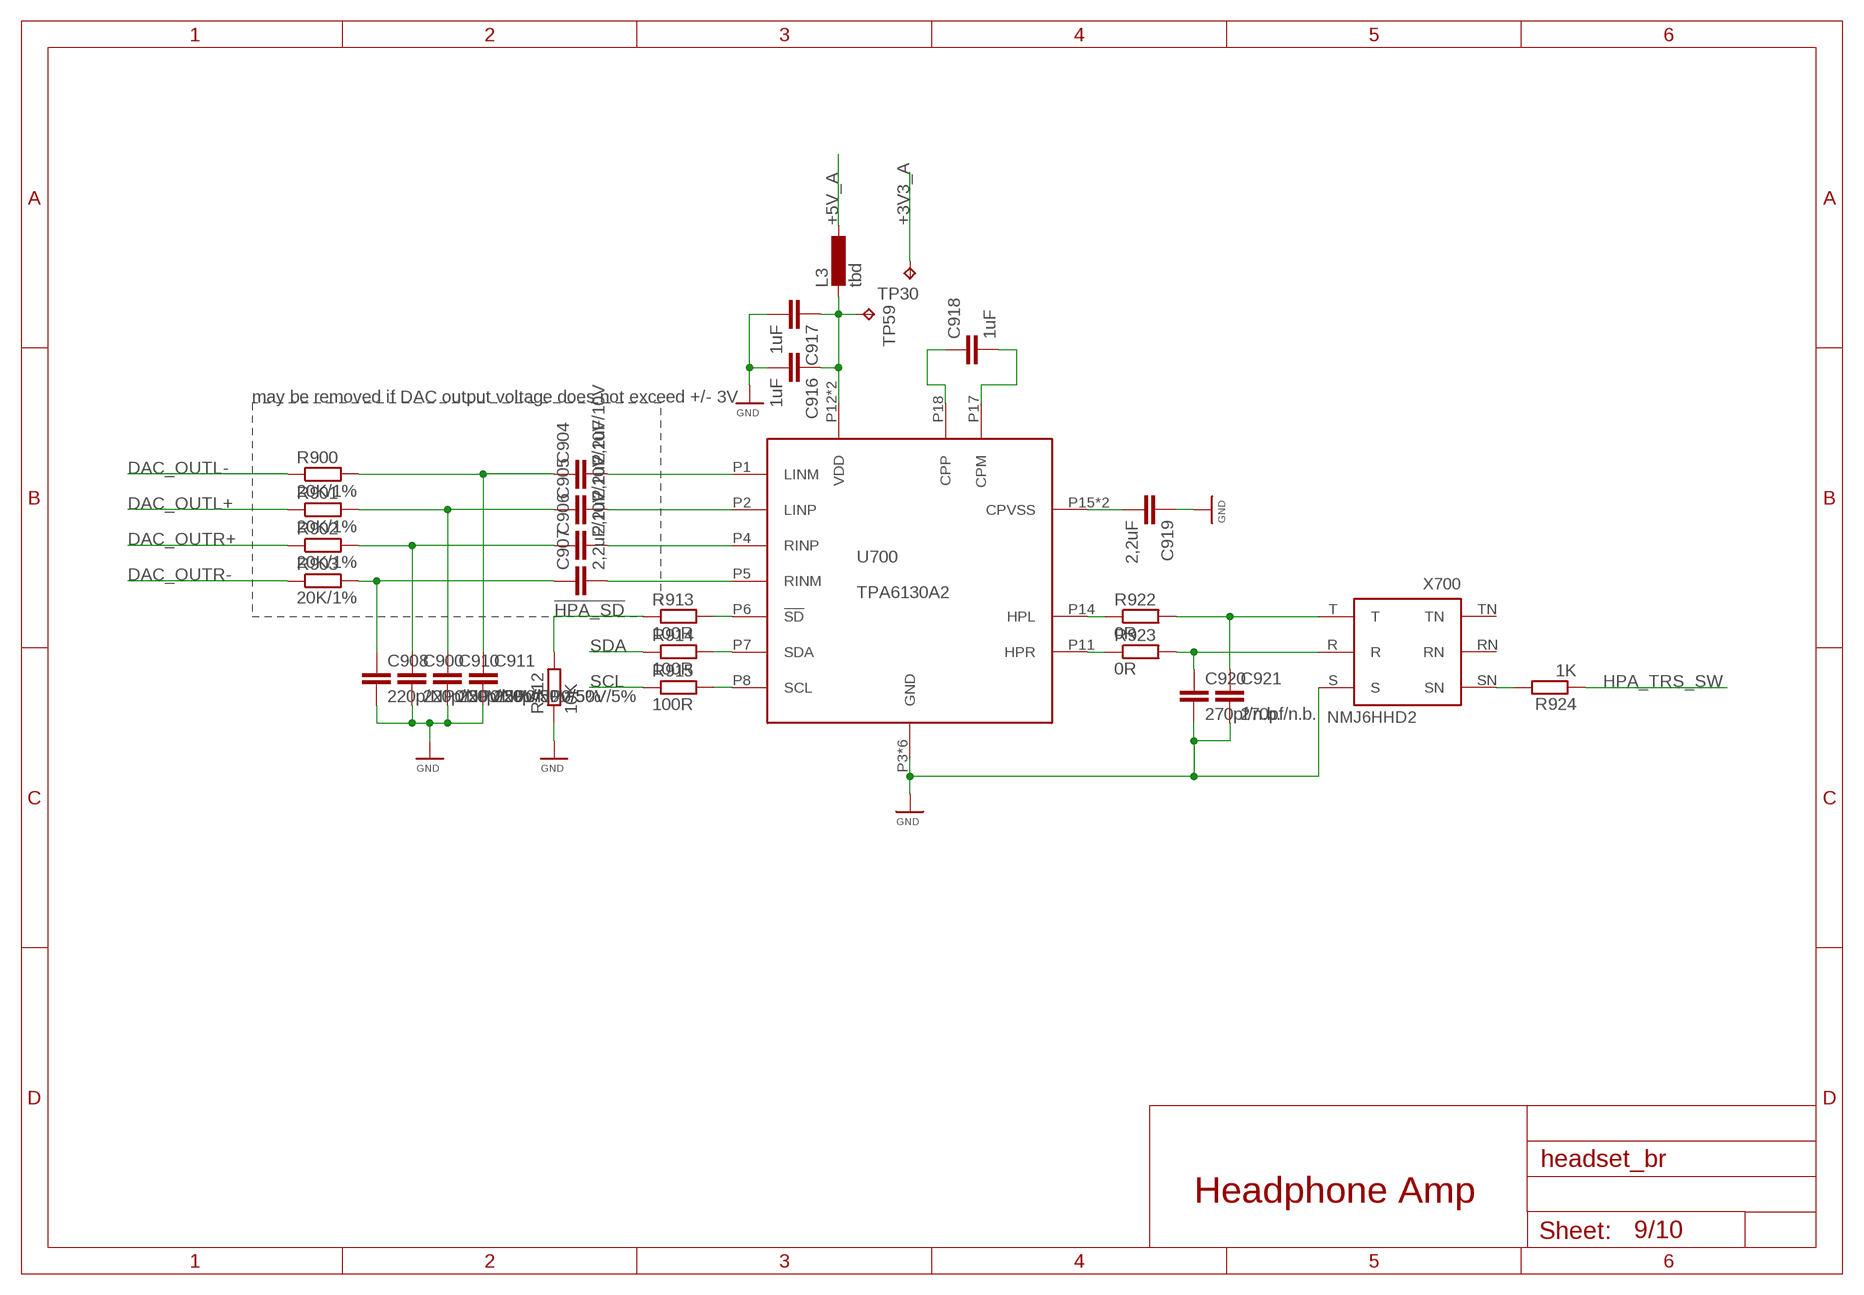
[diagram p8: schematic, sheet 9]
FRAME8 (FRAME): EXCLUDE_FROM_BOM: YES

### Parts
C900  220p/NP0/50V/5%  C0603  [C0603]
C904  2,2uF/10V  C0603  [C0603]
C905  2,2uF/10V  C0603  [C0603]
C906  2,2uF/10V  C0603  [C0603]
C907  2,2uF/10V  C0603  [C0603]
C908  220p/NP0/50V/5%  C0603  [C0603]
C910  220p/NP0/50V/5%  C0603  [C0603]
C911  220p/NP0/50V/5%  C0603  [C0603]
C916  1uF  C0603  [C0603]
C917  1uF  C0603  [C0603]
C918  1uF  C0603  [C0603]
C919  2,2uF  C0603  [C0603]
C920  270pf/n.b.  C0603  [C0603]
C921  270pf/n.b.  C0603  [C0603]
L3  tbd  L0805  [R0805]
R900  20K/1%  R0603  [R0603]
R901  20K/1%  R0603  [R0603]
R902  20K/1%  R0603  [R0603]
R903  20K/1%  R0603  [R0603]
R912  10K  R0603  [R0603]
R913  100R  R0603  [R0603]
R914  100R  R0603  [R0603]
R915  100R  R0603  [R0603]
R922  0R  R0603  [R0603]
R923  0R  R0603  [R0603]
R924  1K  R0603  [R0603]
TP30  TPS  [TESTPAD_SMALL]
TP59  TPS  [TESTPAD_SMALL]
U700  TPA6130A2  [TPA6130A2-QFN]
X700  NMJ6HHD2  [NMJ6HHD2]

### Nets
!HPA_SD: R912.2 R913.1 ; also sheet 4
+3V3_A: TP30.P$1(TP) ; also sheet 2,7,8
+5V_A: L3.1 ; also sheet 2,7,8
DAC_OUTL+: R901.1 ; also sheet 8
DAC_OUTL-: R900.1 ; also sheet 8
DAC_OUTR+: R902.1 ; also sheet 8
DAC_OUTR-: R903.1 ; also sheet 8
GND: C900.2 C908.2 C910.2 C911.2 C916.2 C917.2 C919.1 C920.2 C921.2 R912.1 U700.P3(GND) U700.P9(GND) U700.P10(GND) U700.P13(GND) U700.P19(GND) U700.POWERPAD(GND) X700.S ; also sheet 2,3,4,5,6,7,8,10
HPA_LIN+: C905.1 C910.1 R901.2
HPA_LIN-: C904.1 C911.1 R900.2
HPA_RIN+: C900.1 C906.1 R902.2
HPA_RIN-: C907.1 C908.1 R903.2
HPA_TRS_SW: R924.1 ; also sheet 4
N$20: C918.1 U700.P18(CPP)
N$21: C918.2 U700.P17(CPM)
N$23: C919.2 U700.P15(CPVSS) U700.P16(CPVSS)
N$24: C907.2 U700.P5(RINM)
N$25: C906.2 U700.P4(RINP)
N$26: C905.2 U700.P2(LINP)
N$27: C904.2 U700.P1(LINM)
N$28: R922.1 U700.P14(HPL)
N$29: C921.1 R922.2 X700.T
N$32: R923.1 U700.P11(HPR)
N$33: C920.1 R923.2 X700.R
N$72: R914.2 U700.P7(SDA)
N$73: R915.2 U700.P8(SCL)
N$74: R913.2 U700.P6(!SD)
N$84: R924.2 X700.SN
N$97: C916.1 C917.1 L3.2 TP59.P$1(TP) U700.P12(VDD) U700.P20(VDD)
SCL: R915.1 ; also sheet 4,8
SDA: R914.1 ; also sheet 4,8
Unconnected: X700.RN X700.TN

### Notes on the sheet
- may be removed if DAC output voltage does not exceed +/- 3V
- Headphone Amp

## Sheet 10 of 10
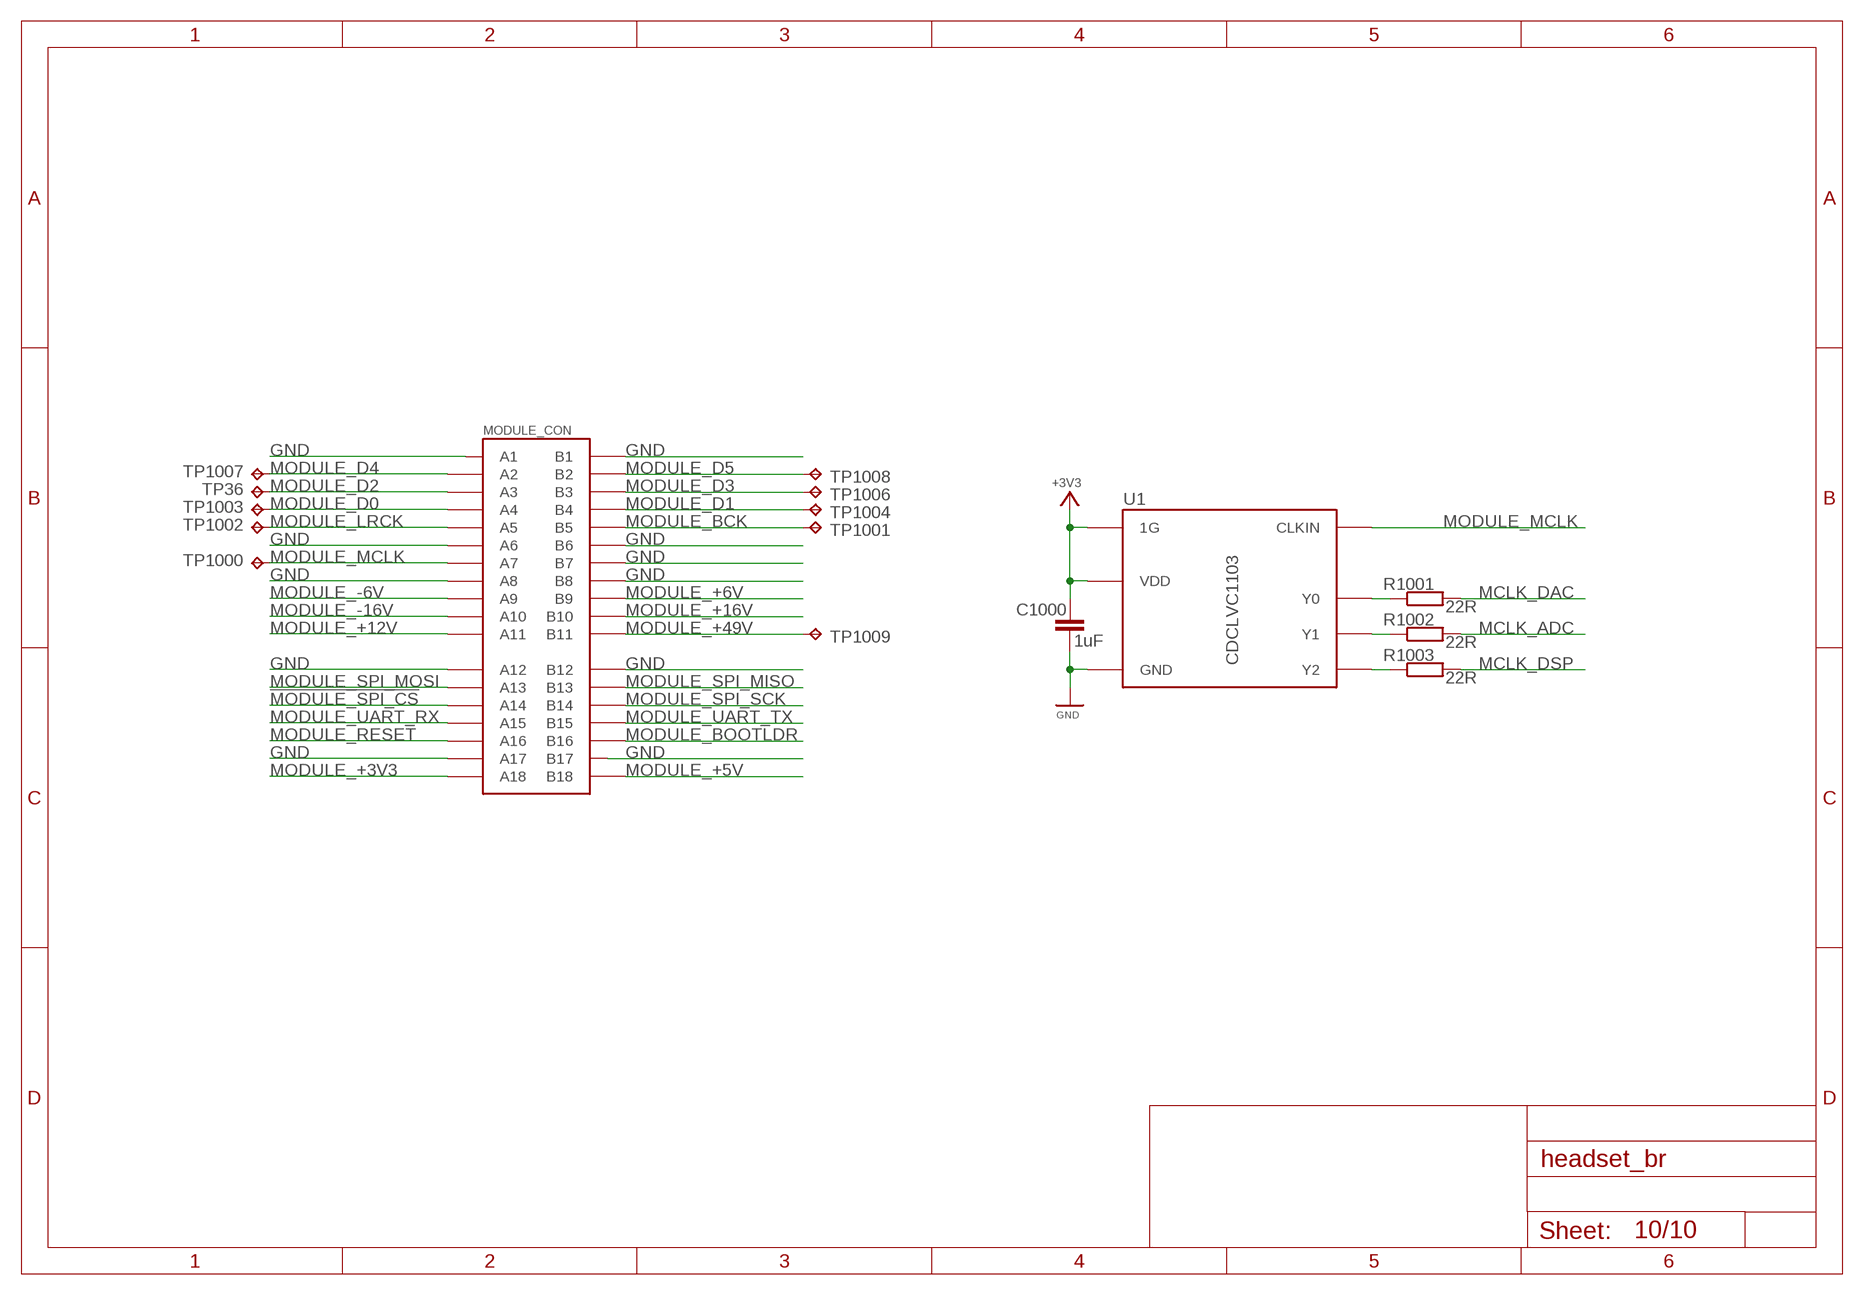
[diagram p9: schematic, sheet 10]
FRAME9 (FRAME): EXCLUDE_FROM_BOM: YES

### Parts
C1000  1uF  C0603  [C0603]
MODULE_CON  PCIE-36-EDGE  [PCIE-36-EDGE]
R1001  22R  R0603  [R0603]
R1002  22R  R0603  [R0603]
R1003  22R  R0603  [R0603]
TP36  TPS  [TESTPAD_SMALL]
TP1000  TPS  [TESTPAD_SMALL]
TP1001  TPS  [TESTPAD_SMALL]
TP1002  TPS  [TESTPAD_SMALL]
TP1003  TPXS  [TESTPAD_EXTRA_SMALL]
TP1004  TPS  [TESTPAD_SMALL]
TP1006  TPS  [TESTPAD_SMALL]
TP1007  TPS  [TESTPAD_SMALL]
TP1008  TPS  [TESTPAD_SMALL]
TP1009  TPS  [TESTPAD_SMALL]
U1  CDCLVC1103  [TSSOP8]

### Nets
!MODULE_SPI_CS: MODULE_CON.A14 ; also sheet 4
+3V3: C1000.1 U1.2(1G) U1.6(VDD) ; also sheet 2,4,5
GND: C1000.2 MODULE_CON.A1 MODULE_CON.A6 MODULE_CON.A8 MODULE_CON.A12 MODULE_CON.A17 MODULE_CON.B1 MODULE_CON.B6 MODULE_CON.B7 MODULE_CON.B8 MODULE_CON.B12 MODULE_CON.B17 U1.4(GND) ; also sheet 2,3,4,5,6,7,8,9
MCLK_ADC: R1002.2 ; also sheet 7
MCLK_DAC: R1001.2 ; also sheet 8
MCLK_DSP: R1003.2 ; also sheet 5
MODULE_+3V3: MODULE_CON.A18 ; also sheet 2
MODULE_+5V: MODULE_CON.B18 ; also sheet 2
MODULE_+6V: MODULE_CON.B9 ; also sheet 2
MODULE_+12V: MODULE_CON.A11
MODULE_+16V: MODULE_CON.B10
MODULE_+49V: MODULE_CON.B11 TP1009.P$1(TP) ; also sheet 3
MODULE_-6V: MODULE_CON.A9 ; also sheet 2
MODULE_-16V: MODULE_CON.A10
MODULE_BCK: MODULE_CON.B5 TP1001.P$1(TP) ; also sheet 5,7,8
MODULE_BOOTLDR: MODULE_CON.B16 ; also sheet 4
MODULE_D0: MODULE_CON.A4 TP1003.P$1(TP) ; also sheet 5
MODULE_D1: MODULE_CON.B4 TP1004.P$1(TP) ; also sheet 5
MODULE_D2: MODULE_CON.A3 TP36.P$1(TP) ; also sheet 5
MODULE_D3: MODULE_CON.B3 TP1006.P$1(TP) ; also sheet 5
MODULE_D4: MODULE_CON.A2 TP1007.P$1(TP) ; also sheet 5
MODULE_D5: MODULE_CON.B2 TP1008.P$1(TP) ; also sheet 5
MODULE_LRCK: MODULE_CON.A5 TP1002.P$1(TP) ; also sheet 5,7,8
MODULE_MCLK: MODULE_CON.A7 TP1000.P$1(TP) U1.1(CLKIN)
MODULE_RESET: MODULE_CON.A16 ; also sheet 4
MODULE_SPI_MISO: MODULE_CON.B13 ; also sheet 4
MODULE_SPI_MOSI: MODULE_CON.A13 ; also sheet 4
MODULE_SPI_SCK: MODULE_CON.B14 ; also sheet 4
MODULE_UART_RX: MODULE_CON.A15 ; also sheet 4
MODULE_UART_TX: MODULE_CON.B15 ; also sheet 4
N$77: R1001.1 U1.3(Y0)
N$78: R1002.1 U1.8(Y1)
N$79: R1003.1 U1.5(Y2)

## Library data of the parts
C1 C2 C6 C7 = plr_rcl:C; MANUFACTURER: Yageo; MPN: CC0805ZKY5V6BB106; OC_DIGIKEY: 311-1355-1-ND; OC_FARNELL: 9402144
C3 C18 C32 C100 C102 C104 C206 = plr_rcl:C; MANUFACTURER: TDK; MPN: C2012X7R1A106K125AC; OC_DIGIKEY: 445-6857-1-ND; OC_FARNELL: 2346934; OC_MOUSER: 810-C2012X7R1A106K
C4 C411-C413 = plr_rcl:CPOL; MANUFACTURER: AVX; MPN: TAJB475K020RNJ; OC_DIGIKEY: 478-3887-1-ND; OC_FARNELL: 197403; OC_MOUSER: 581-TAJB475K020
C8 C9 C400 C401 C916-C918 C1000 = plr_rcl:C; MANUFACTURER: TDK; MPN: C1608X7R1C105K080AC; OC_DIGIKEY: 445-1604-1-ND; OC_FARNELL: 1907343; OC_MOUSER: 810-C1608X7R1C105K
C11 C20 C21 C40 C42-C44 C200-C205 C300-C308 C402-C406 C500-C503 = plr_rcl:C; MANUFACTURER: AVX; MPN: 0603YC104KAT2A; OC_DIGIKEY: 478-1239-1-ND; OC_FARNELL: 1327679; OC_MOUSER: 581-060316C104K
C17 C19 C31 = plr_rcl:C; MANUFACTURER: TDK; MPN: C1608C0G1H103J080AA; OC_DIGIKEY: 445-7404-1-ND; OC_FARNELL: 1907314; OC_MOUSER: 810-C1608C0G1H103J
C22 C309-C311 = plr_rcl:C; MANUFACTURER: Kemet; MPN: C1206C106K4RACTU; OC_DIGIKEY: 399-3525-1-ND; OC_FARNELL: 2392400; OC_MOUSER: 80-C1206C106K4R
C23 C24 C28 = plr_rcl:C; MANUFACTURER: TDK; MPN: CGA3E1X7R1C474K080AC; OC_DIGIKEY: 445-5672-1-ND; OC_FARNELL: 2210843; OC_MOUSER: 810-CGA3E1X7R1C474K
C25 = plr_rcl:C; MANUFACTURER: TDK; MPN: C0603C0G1H470J030BA; OC_DIGIKEY: 445-1782-1-ND; OC_MOUSER: 810-C0603C0G1H470J
C26 C27 = plr_rcl:CPOL; MANUFACTURER: Panasonic; MPN: EEE-FK1E470P; OC_DIGIKEY: PCE3804CT-ND; OC_FARNELL: 9695753; OC_MOUSER: 667-EEE-FK1E470P
C29 C30 = plr_rcl:C; MANUFACTURER: Murata; MPN: GRM31CR61H106KA12L; OC_DIGIKEY: 490-5961-1-ND; OC_FARNELL: 1845762; OC_MOUSER: 81-GRM31CR61H106KA2L
C39 C41 = plr_rcl:CPOL; MANUFACTURER: AVX; MPN: F931A106KAA; OC_DIGIKEY: 478-8192-1-ND; OC_MOUSER: 647-F931A106KAA
C207 C208 = plr_rcl:C; MANUFACTURER: Kemet; MPN: C0603C180J5GACTU; OC_DIGIKEY: 399-1052-1-ND; OC_FARNELL: 1414620; OC_MOUSER: 80-C0603C180J5G
C312 = plr_rcl:C; MANUFACTURER: Kemet; MPN: C0603C332K5RACTU; OC_DIGIKEY: 399-1086-1-ND; OC_FARNELL: 1414635; OC_MOUSER: 80-C0603C332K5R
C313 = plr_rcl:C; MANUFACTURER: Vishay; MPN: VJ0603Y563KXJPW1BC; OC_MOUSER: 77-VJ0603Y563KXJPBC
C407 = plr_rcl:C; MANUFACTURER: Murata; MPN: GRM033R61A272KA01D; OC_DIGIKEY: 490-6141-1-ND; OC_MOUSER: 81-GRM033R61A272KA1D
C408 C409 C416 C417 = plr_rcl:C; MANUFACTURER: AVX; MPN: 06035A101JAT2A; OC_DIGIKEY: 478-1175-1-ND; OC_FARNELL: 499122; OC_MOUSER: 581-06035A101J
C410 C920 C921 = plr_rcl:C
C414 C415 = plr_rcl:CPOL; MANUFACTURER: Panasonic; MPN: EEEFK1J470P; OC_DIGIKEY: PCE3823CT-ND; OC_FARNELL: 9696032; OC_MOUSER: EEE-FK1J470P
C504 = plr_rcl:CPOL; MANUFACTURER: Vishay; MPN: TR3B476K010C0350; OC_DIGIKEY: 718-1768-1-ND; OC_FARNELL: 74-TR3B476K010C0350
C505 C506 = plr_rcl:CPOL; MANUFACTURER: Kemet; MPN: EDK476M010A9DAA; OC_FARNELL: 2068642
C900 C908 C910 C911 = plr_rcl:C; MANUFACTURER: Kemet; MPN: C0603C221J5GACTU; OC_FARNELL: 1414623; OC_MOUSER: 80-C0603C221J5G
C904-C907 C919 = plr_rcl:C; MANUFACTURER: TDK; MPN: C1608X7R1A225K080AC; OC_DIGIKEY: 445-5958-1-ND; OC_FARNELL: 2346896; OC_MOUSER: 810-C1608X7R1A225K
D3 D5 = plr_diodes:BAS40: Silicon Schottky Diodes General-purpose diode for high-speed switching; MANUFACTURER: NXP; MPN: BAS40,215; OC_DIGIKEY: 568-4861-6-ND; OC_FARNELL: 8734291; OC_MOUSER: 771-BAS40-T/R
D400 D401 = plr_diodes:D-ZENER; MANUFACTURER: Vishay; MPN: BZG05C5V6TR; OC_DIGIKEY: BZG05C5V6CT-ND; OC_FARNELL: 1612397; OC_MOUSER: 78-BZG05C5V6
D402-D405 = plr_diodes:MBRA120ET3G; MANUFACTURER: ON Semiconductor; MPN: MBRA120ET3G; OC_DIGIKEY: MBRA120ET3GOSCT-ND; OC_FARNELL: 1431075; OC_MOUSER: 863-MBRA120ET3G
DUOLED = plr_diodes:MENTOR-2LED; MANUFACTURER: MENTOR; MPN: 1801.8231; OC_REICHELT: MEN 1801.8231
L1-L6 L200 = plr_rcl:L
LDO100 = plr_vreg:MCP1700; MANUFACTURER: Microchip; MPN: MCP1702T-3302E/CB; OC_DIGIKEY: MCP1702T-3302E/CBCT-ND; OC_FARNELL: 1331490; OC_MOUSER: 579-MCP1702T3302E/CB
LDO101 = plr_vreg:MCP1700; MANUFACTURER: Microchip; MPN: MCP1702T-5002E/CB; OC_DIGIKEY: MCP1702T-5002E/CBCT-ND; OC_FARNELL: 1331491; OC_MOUSER: 579-MCP1702T5002E/CB
LDO102 = plr_vreg:LP2985; MANUFACTURER: TI; MPN: LP2985-50DBVR; OC_DIGIKEY: 296-20717-1-ND; OC_FARNELL: 2008643; OC_MOUSER: 595-LP2985-50DBVR
LDO103 = plr_vreg:LT1964-5; MANUFACTURER: Linear Technology; MPN: LT1964ES5-5#TRMPBF; OC_DIGIKEY: LT1964ES5-5#TRMPBFCT-ND; OC_FARNELL: 1663814
LDO104 = plr_vreg:MCP1700; MANUFACTURER: Microchip; MPN: MCP1702T-1802E/CB; OC_DIGIKEY: MCP1702T-1802E/CBCT-ND; OC_FARNELL: 1331488; OC_MOUSER: 579-MCP1702T1802E/CB
LED1-LED3 = plr_diodes:LED
MODULE_CON = plc_con:PCIE-36-*: PCI-E 36-way connectors; EXCLUDE_FROM_BOM: YES
R1 R39 R201 R312 R924 = plr_rcl:R; MANUFACTURER: Vishay; MPN: CRCW06031K00FKEA; OC_DIGIKEY: 541-1.00KHCT-ND; OC_FARNELL: 1469740; OC_MOUSER: 71-CRCW0603-1.0K-E3
R2 R3 R11 R12 R15 R16 R20-R22 R65 R67 R200 R204 R205 R505 R912 = plr_rcl:R; MANUFACTURER: Panasonic; MPN: ERJ-3EKF1002V; OC_DIGIKEY: P10.0KHCT-ND; OC_FARNELL: 1987593; OC_MOUSER: 667-ERJ-3EKF1002V
R13 R14 R38 R66 R100 R409 R922 R923 = plr_rcl:R
R17-R19 R24 R25 R27 R32 R33 R41-R52 R410-R413 R512-R515 R913-R915 = plr_rcl:R; MANUFACTURER: Panasonic; MPN: ERJ-3EKF1000V; OC_DIGIKEY: P100HCT-ND; OC_FARNELL: 2303059; OC_MOUSER: 667-ERJ-3EKF1000V
R37 R300 = plr_rcl:R; MANUFACTURER: Panasonic; MPN: ERJ-3EKF4750V; OC_DIGIKEY: P475HCT-ND; OC_FARNELL: 2059310; OC_MOUSER: 667-ERJ-3EKF4750V
R54 R55 = plr_rcl:R; MANUFACTURER: Panasonic; MPN: ERJ-3EKF4702V; OC_DIGIKEY: P47.0KHCT-ND; OC_FARNELL: 1991766; OC_MOUSER: 667-ERJ-3EKF4702V
R56 R57 = plr_rcl:R; MANUFACTURER: Vishay; MPN: TNPW12069K09BEEA; OC_DIGIKEY: TNP9.09KACCT-ND; OC_MOUSER: 71-TNPW12069K09BEEA
R58 R59 = plr_rcl:R; MANUFACTURER: Panasonic; MPN: ERJ-8ENF1101V; OC_DIGIKEY: P1.10KFCT-ND; OC_FARNELL: 2283515; OC_MOUSER: 667-ERJ-8ENF1101V
R60 = plr_rcl:R; MANUFACTURER: Panasonic; MPN: ERJ-8ENF2670V; OC_DIGIKEY: P267FCT-ND; OC_FARNELL: 2359456; OC_MOUSER: 667-ERJ-8ENF2670V
R61 R62 = plr_rcl:R; MANUFACTURER: Panasonic; MPN: ERA-6AEB1211V; OC_DIGIKEY: P1.21KDACT-ND; OC_MOUSER: 667-ERA-6AEB1211V
R63 = plr_rcl:R; MANUFACTURER: Panasonic; MPN: ERJ-3EKF4422V; OC_DIGIKEY: P44.2KHCT-ND; OC_FARNELL: 2059467; OC_MOUSER: 667-ERJ-3EKF4422V
R64 = plr_rcl:R; MANUFACTURER: Panasonic; MPN: ERJ-3EKF1101V; OC_DIGIKEY: P1.10KHCT-ND; OC_FARNELL: 2059329; OC_MOUSER: 667-ERJ-3EKF1101V
R202 R203 = plr_rcl:R; MANUFACTURER: Panasonic; MPN: ERJ-3EKF4701V; OC_DIGIKEY: P4.70KHCT-ND; OC_FARNELL: 2304687; OC_MOUSER: 667-ERJ-3EKF4701V
R400 R405 R406 = plr_rcl:R; MANUFACTURER: Bourns; MPN: CRT1206-BY-10R0ELF; OC_DIGIKEY: CRT1206-BY-10R0ELFCT-ND; OC_FARNELL: 2008318; OC_MOUSER: 652-CRT1206BY10R0ELF
R401 R402 = plr_rcl:R; MANUFACTURER: Vishay; MPN: PHP00805E40R2BST1; OC_MOUSER: 71-PHP00805E40R2BST1
R407 R408 = plr_rcl:R; MANUFACTURER: Vishay; MPN: TNPW12066K81BEEN; OC_DIGIKEY: TNPW12066K81BEEN-ND; OC_MOUSER: 71-TNPW12066K81BEEN
R900-R903 = plr_rcl:R; MANUFACTURER: Panasonic; MPN: ERJ-3EKF2002V; OC_DIGIKEY: P20.0KHCT-ND; OC_FARNELL: 2059432; OC_MOUSER: 667-ERJ-3EKF2002V
R1001-R1003 = plr_rcl:R; MANUFACTURER: Panasonic; MPN: ERJ-3EKF22R0V; OC_DIGIKEY: P22.0HCT-ND; OC_FARNELL: 2346653; OC_MOUSER: 667-ERJ-3EKF22R0V
TP1 TP2 TP15-TP30 TP36 TP40-TP59 TP1000-TP1004 TP1006-TP1009 = plr_common:TP
TP3-TP14 = plr_common:TP; EXCLUDE_FROM_BOM: YES
U1 = plr_ic:CDCLVC1103; MANUFACTURER: TI; MPN: CDCLVC1103PWR; OC_DIGIKEY: 296-27587-1-ND; OC_FARNELL: 2352246; OC_MOUSER: 595-CDCLVC1103PWR
U2-U5 = plr_transistor:2N7002; MANUFACTURER: NXP; MPN: 2N7002,215; OC_DIGIKEY: 568-1369-1-ND; OC_FARNELL: 1510761; OC_MOUSER: 771-2N7002-T/R
U300 = plr_ic:ADAU1701/02; MANUFACTURER: AnalogDevices; MPN: ADAU1701JSTZ; OC_DIGIKEY: ADAU1701JSTZ-ND; OC_FARNELL: 1498728; OC_MOUSER: 584-ADAU1701JSTZ
U400 = plr_ic:PGA2505; MANUFACTURER: TI; MPN: PGA2505IDB; OC_DIGIKEY: 296-24572-5-ND; OC_FARNELL: 1735567; OC_MOUSER: 595-PGA2505IDB
U500 = plr_ic:PCM4202; MANUFACTURER: TI; MPN: PCM4202DBT; OC_DIGIKEY: 296-17438-1-ND; OC_FARNELL: 1180153; OC_MOUSER: 595-PCM4202DBT
U600 = plr_ic:PCM1791A; MANUFACTURER: TI; MPN: PCM1791ADB; OC_DIGIKEY: 296-15091-5-ND; OC_FARNELL: 1648630; OC_MOUSER: 595-PCM1791ADB
U700 = plr_ic:TPA6130A2; MANUFACTURER: TI; MPN: TPA6130A2RTJR; OC_DIGIKEY: 296-21656-1-ND; OC_FARNELL: 1697156; OC_MOUSER: 595-TPA6130A2RTJR
UC200 = plr_ic:STM32F100XX; MANUFACTURER: ST; MPN: STM32F100C8T6B; OC_DIGIKEY: 497-10499-ND; OC_FARNELL: 1838511; OC_MOUSER: 511-STM32F100C8T6B
VREG400 = plr_vreg:TPS7A41; MANUFACTURER: TI; MPN: TPS7A4101DGNR; OC_DIGIKEY: 296-30081-1-ND; OC_MOUSER: 595-TPS7A4101DGNR
X1 = plc_con:JTAG; MANUFACTURER: FCI; MPN: 20021121-00010C4LF; OC_DIGIKEY: 609-3695-1-ND; OC_FARNELL: 1865279; OC_MOUSER: 649-202112100010C4LF
X200 = plr_crystal:CRYSTAL; MANUFACTURER: ABRACON; MPN: ABM7-8.000MHZ-D2Y-T; OC_DIGIKEY: 535-9831-1-ND; OC_FARNELL: 2101337; OC_MOUSER: 815-ABM7-8-D2Y-T
X400 = con-neutrik_ag:NCJ10FI-: Neutrik Audio Connector XLR SERIES Stereo 1/4" jack with switch Source: www.neutrik.com/; MANUFACTURER: Neutrik; MPN: NCJ10FI-H-0; OC_MOUSER: 568-NCJ10FI-H-0; OC_NEWARK: 99B1398
X700 = plc_con:NMJ6HHD2; MANUFACTURER: Neutrik; MPN: NMJ6HHD2; OC_MOUSER: 550-25382